# EasyEDA Pro project ProPrj_光耦隔离输入.epro

# Schematic Schematic1

## Sheets
1 光耦隔离输出: Board Name: Board1; Create Date: 2025-10-12; Page Name: 光耦隔离输出; Project Name: 光耦隔离输入; Schematic Name: Schematic1; Update Date: 2025-10-21; Company: achenjiayi; Drawed: achenjiayi; Page Size: A4; Reviewed: achenjiayi; Version: V1.0
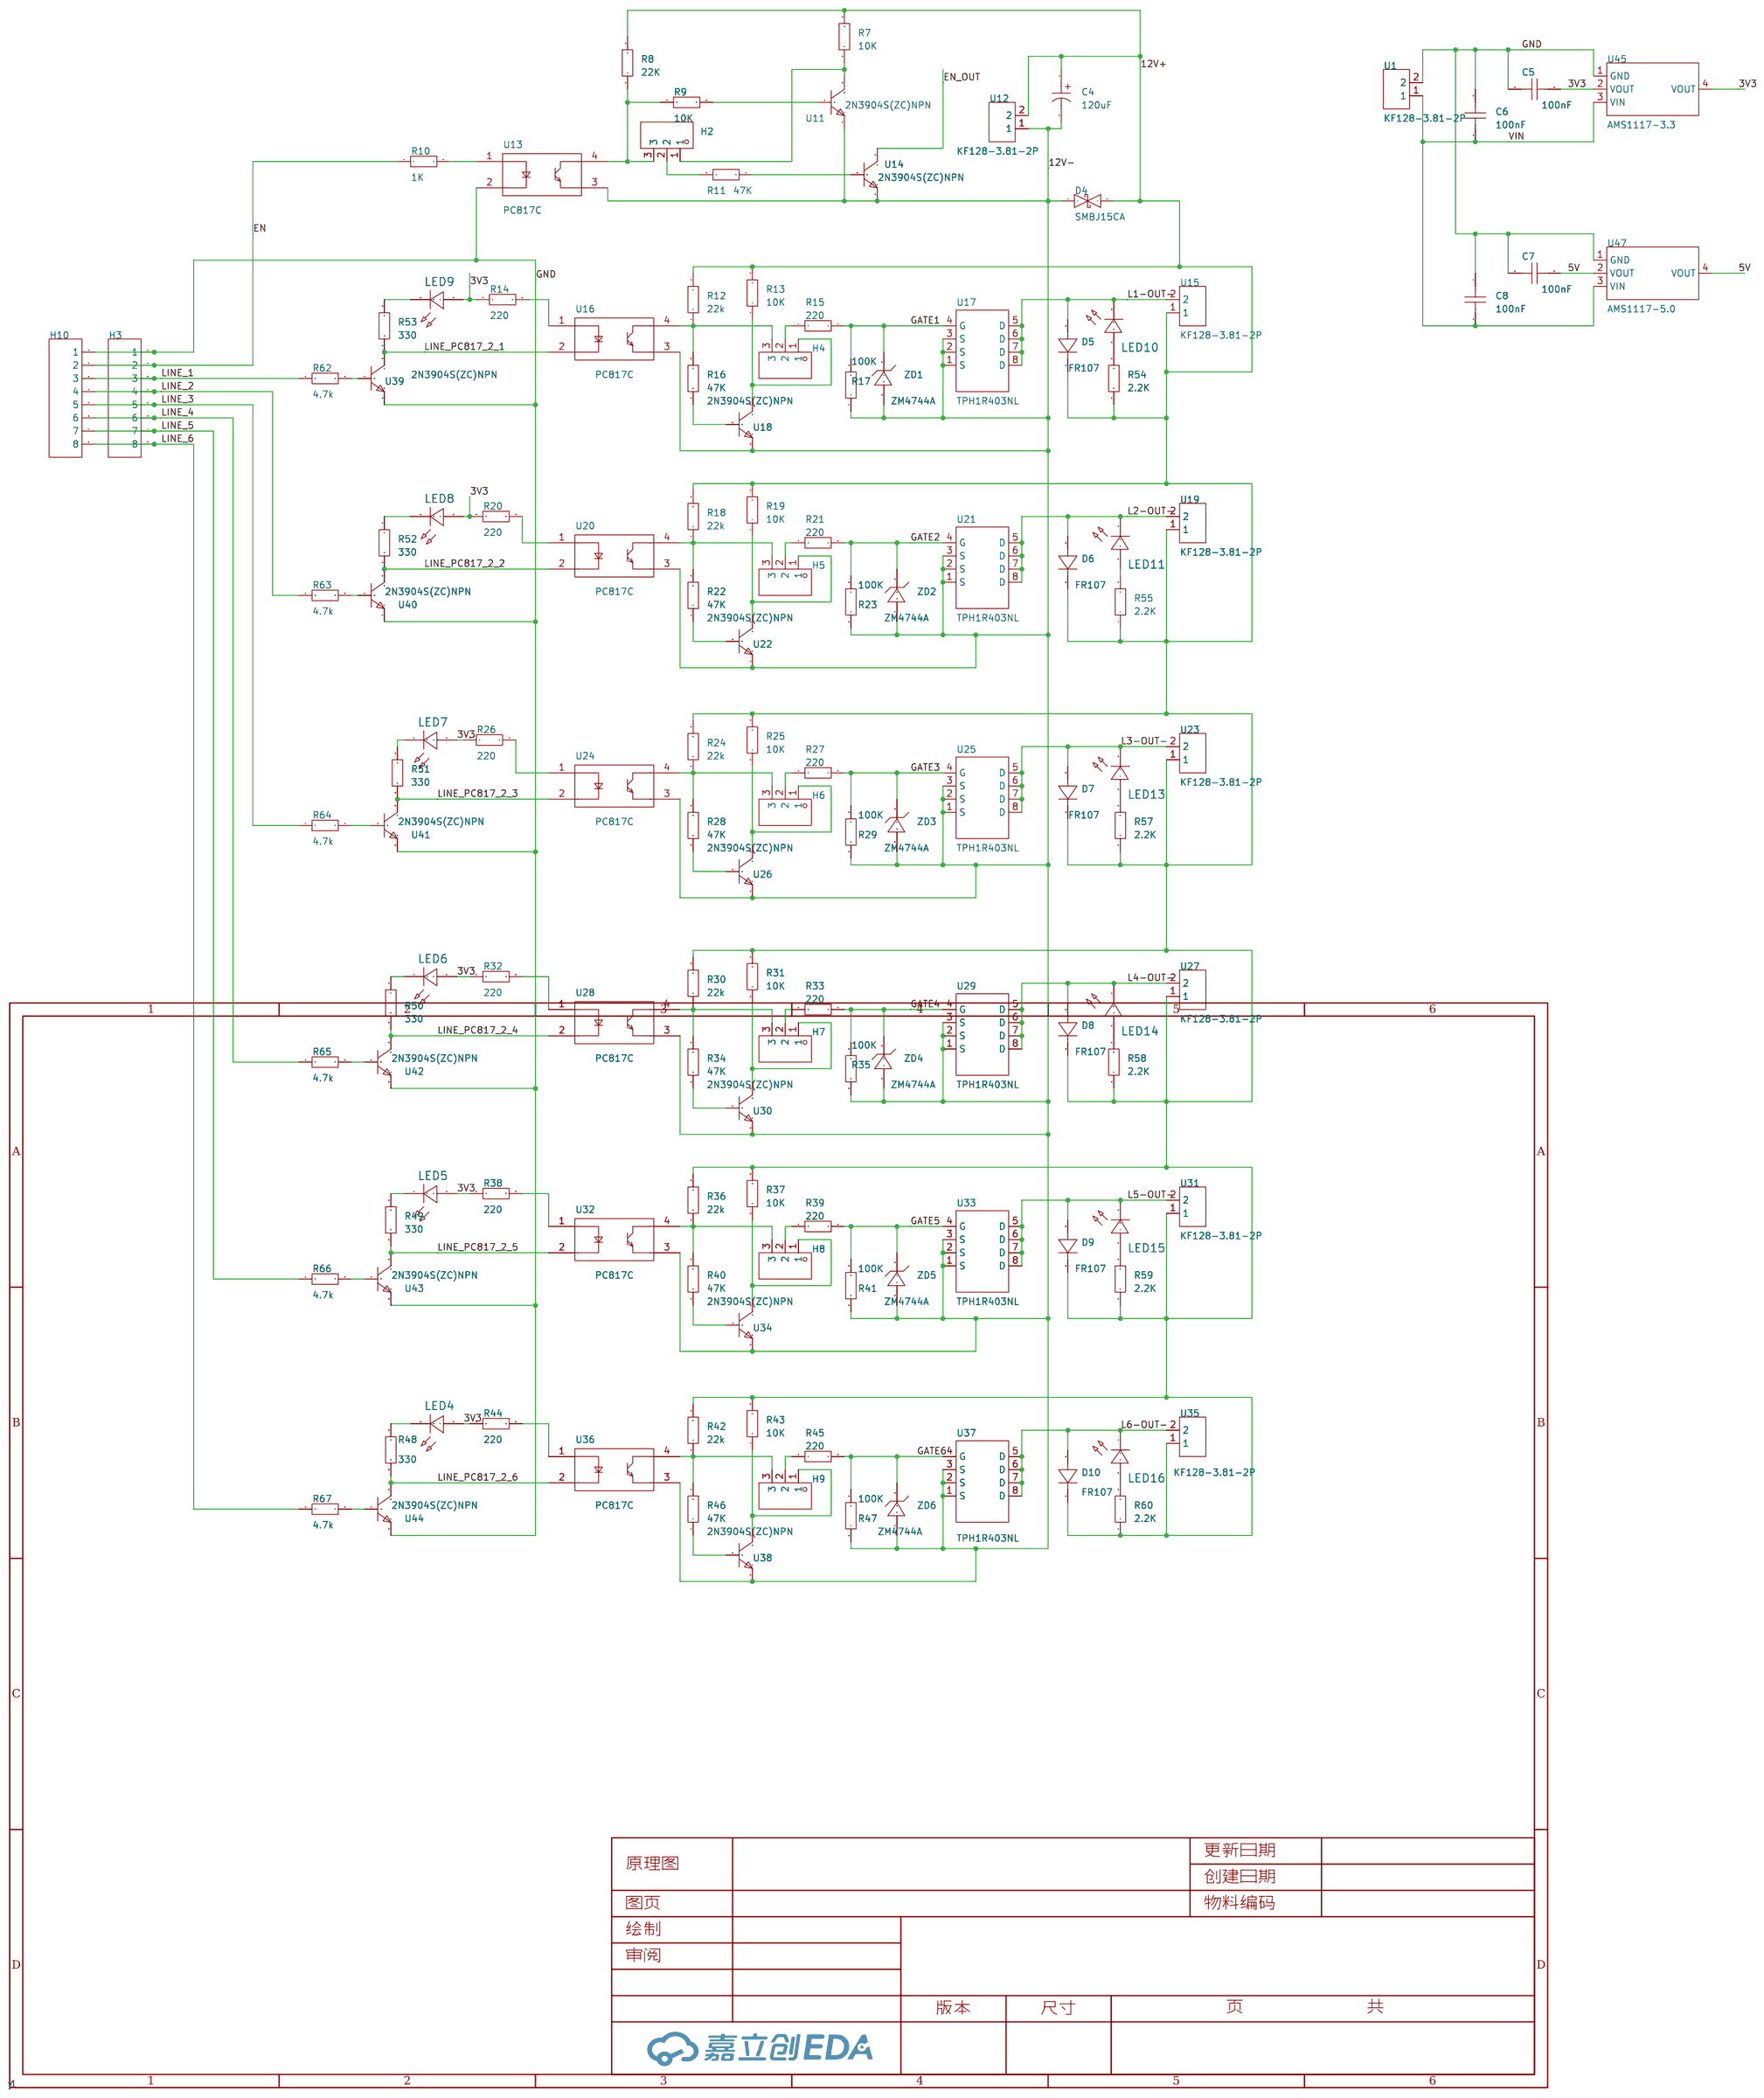
[diagram p0: 光耦隔离输出]
2 光耦隔离输入: Create Date: 2025-10-21; Page Name: 光耦隔离输入; Company: 嘉立创EDA
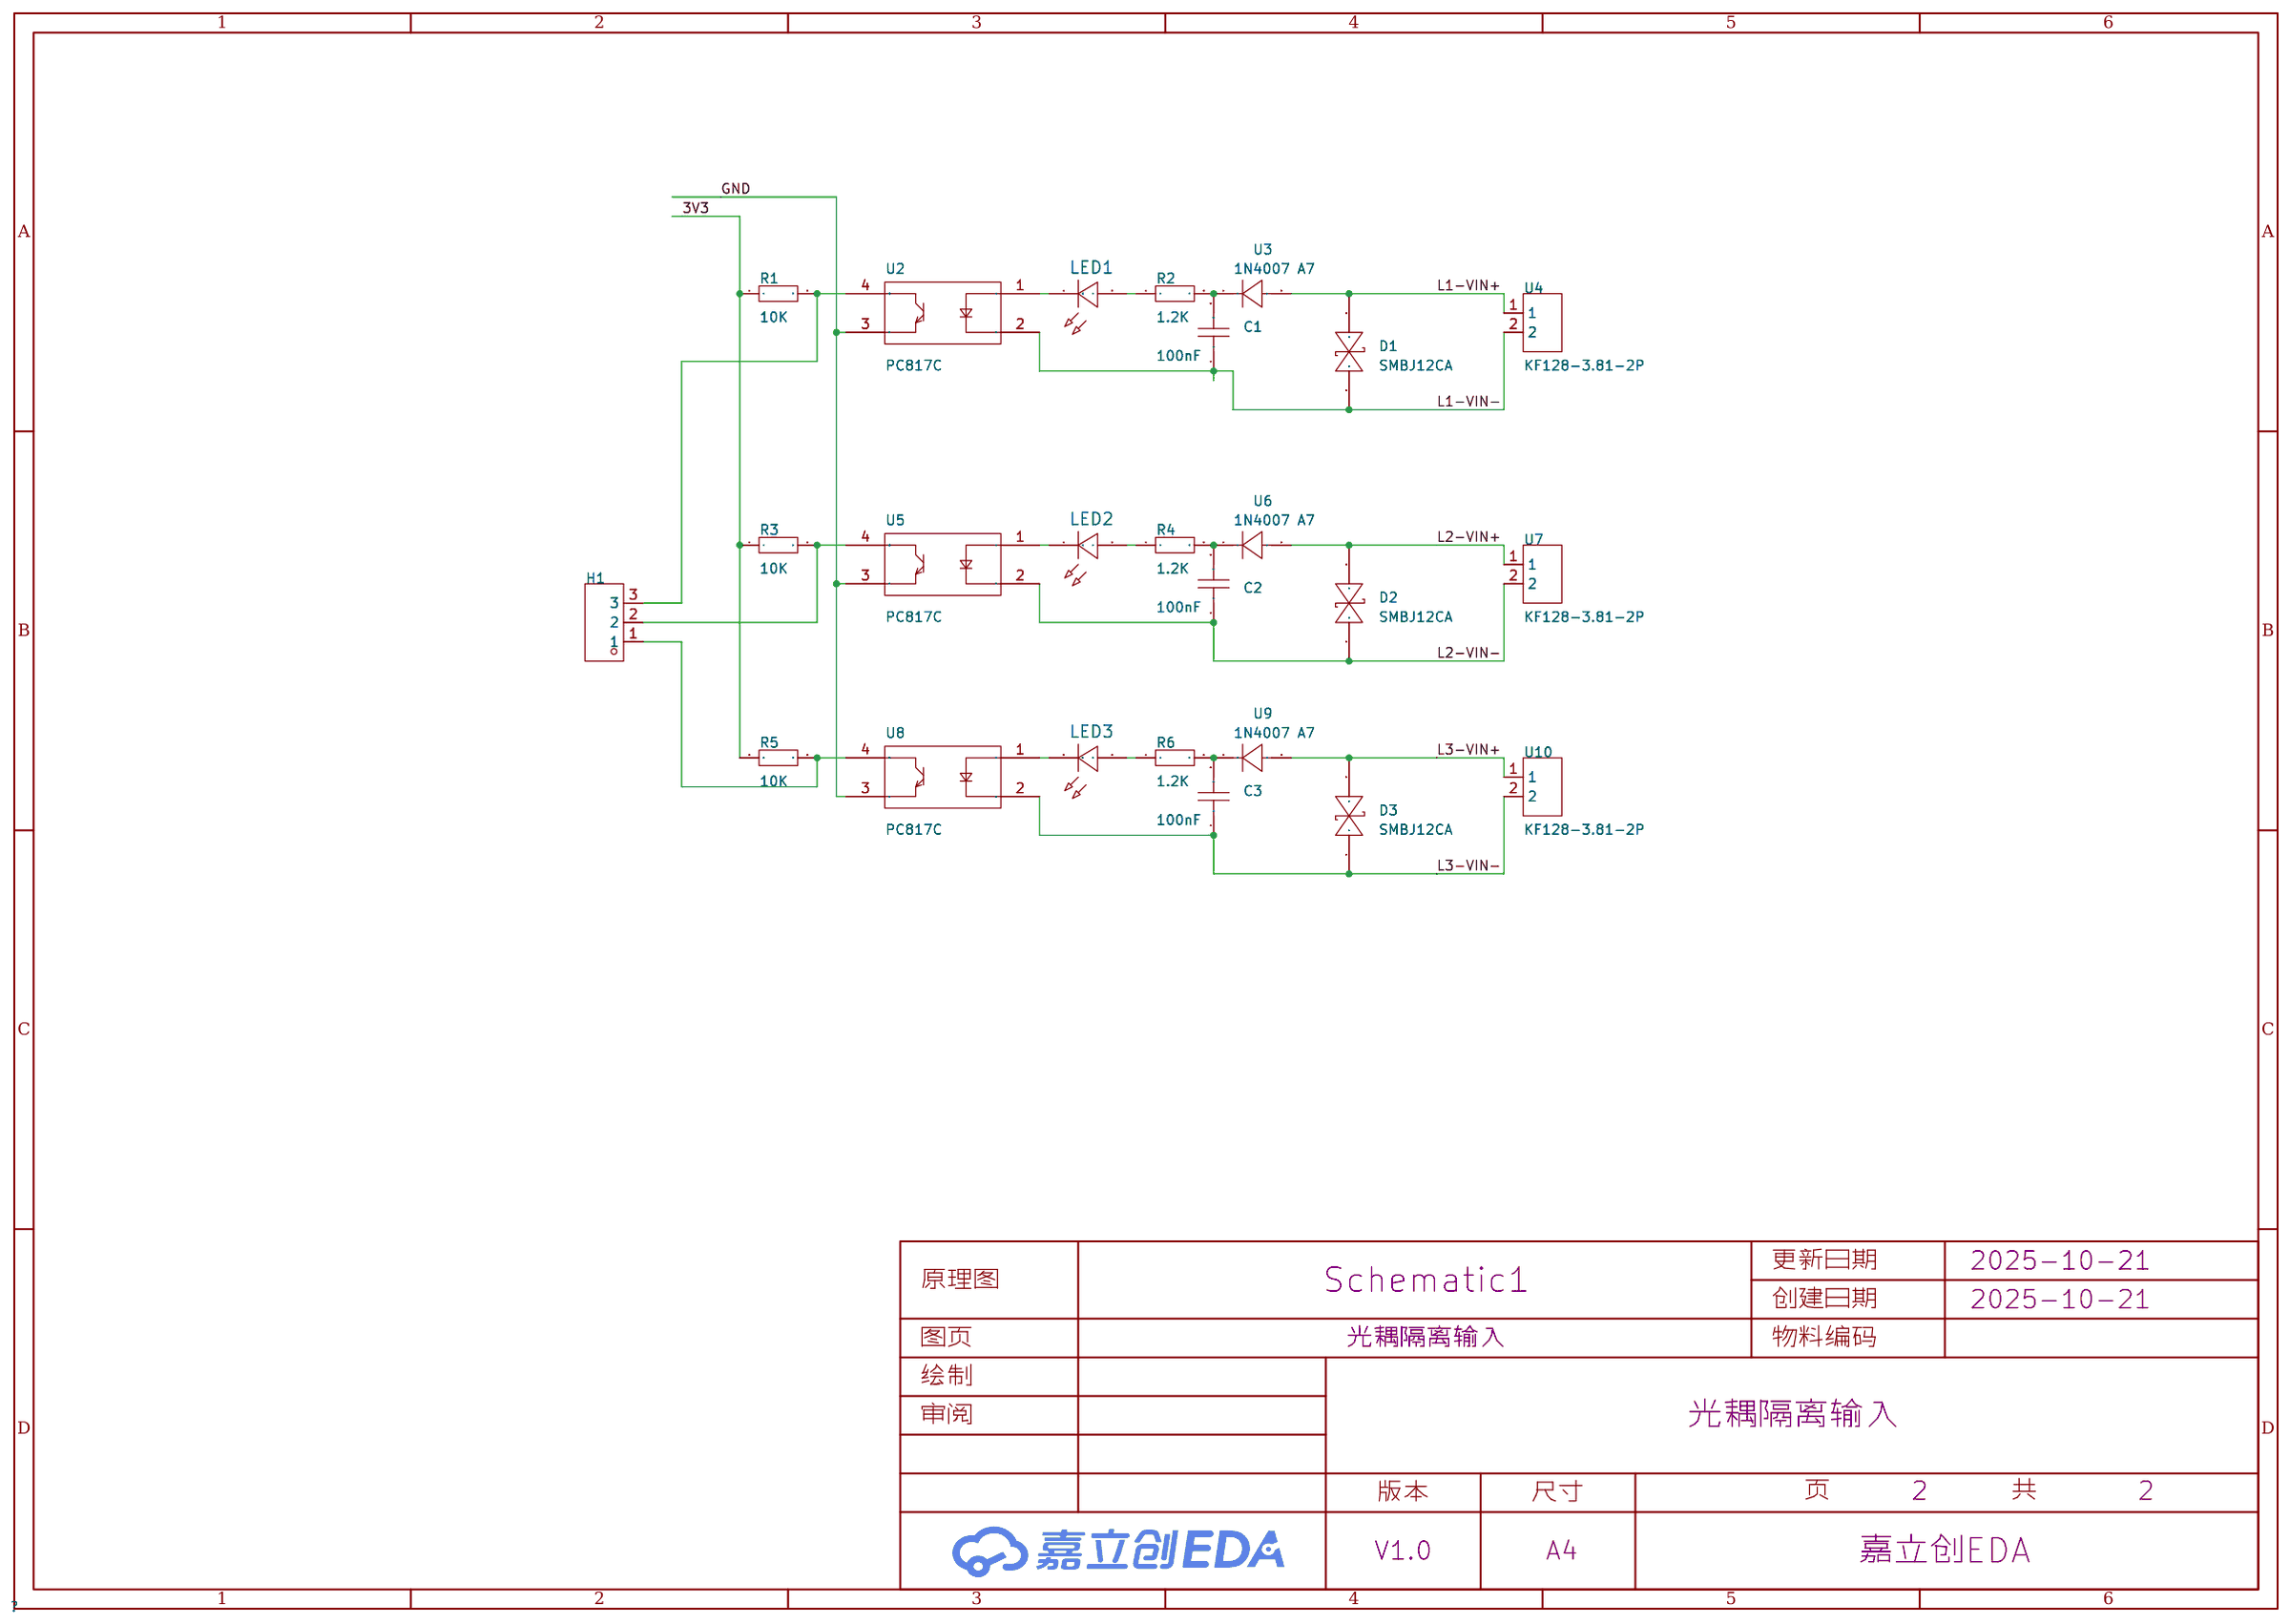
[diagram p1: 光耦隔离输入]

## Parts
sheet 光耦隔离输入
C1  100nF  [C0603]
C2  100nF  [C0603]
C3  100nF  [C0603]
D1  SMBJ12CA  [SMB_L4.6-W3.6-LS5.3-BI]
D2  SMBJ12CA  [SMB_L4.6-W3.6-LS5.3-BI]
D3  SMBJ12CA  [SMB_L4.6-W3.6-LS5.3-BI]
H1  -  [HDR-TH_3P-P2.54-V-M]
LED1  -  [LED_0603]
LED2  -  [LED_0603]
LED3  -  [LED_0603]
R1  10K  [R0603]
R2  1.2K  [R0603]
R3  10K  [R0603]
R4  1.2K  [R0603]
R5  10K  [R0603]
R6  1.2K  [R0603]
U2  PC817C  [OPTO-SMD-4_L4.6-W6.5-P2.54-LS10.3-TL]
U3  1N4007 A7  [SOD-123FL_L2.7-W1.8-LS3.8-RD]
U4  KF128-3.81-2P  [CONN-TH_2P-P3.81_KF128-3.81-2P]
U5  PC817C  [OPTO-SMD-4_L4.6-W6.5-P2.54-LS10.3-TL]
U6  1N4007 A7  [SOD-123FL_L2.7-W1.8-LS3.8-RD]
U7  KF128-3.81-2P  [CONN-TH_2P-P3.81_KF128-3.81-2P]
U8  PC817C  [OPTO-SMD-4_L4.6-W6.5-P2.54-LS10.3-TL]
U9  1N4007 A7  [SOD-123FL_L2.7-W1.8-LS3.8-RD]
U10  KF128-3.81-2P  [CONN-TH_2P-P3.81_KF128-3.81-2P]
sheet 光耦隔离输出
C4  120uF  [CAP-TH_BD6.3-P2.50-D0.5-FD]
C5  100nF  [C0603]
C6  100nF  [C0603]
C7  100nF  [C0603]
C8  100nF  [C0603]
D4  SMBJ15CA  [SMB_L4.6-W3.6-LS5.3-BI]
D5  FR107  [SOD-123_L2.8-W1.8-LS3.7-RD]
D6  FR107  [SOD-123_L2.8-W1.8-LS3.7-RD]
D7  FR107  [SOD-123_L2.8-W1.8-LS3.7-RD]
D8  FR107  [SOD-123_L2.8-W1.8-LS3.7-RD]
D9  FR107  [SOD-123_L2.8-W1.8-LS3.7-RD]
D10  FR107  [SOD-123_L2.8-W1.8-LS3.7-RD]
H2  -  [HDR-TH_3P-P2.54-V-M]
H3  -  [HDR-TH_8P-P2.54-V-M]
H4  -  [HDR-TH_3P-P2.54-V-M]
H5  -  [HDR-TH_3P-P2.54-V-M]
H6  -  [HDR-TH_3P-P2.54-V-M]
H7  -  [HDR-TH_3P-P2.54-V-M]
H8  -  [HDR-TH_3P-P2.54-V-M]
H9  -  [HDR-TH_3P-P2.54-V-M]
H10  -  [HDR-TH_8P-P2.54-V-M]
LED4  -  [LED_0603]
LED5  -  [LED_0603]
LED6  -  [LED_0603]
LED7  -  [LED_0603]
LED8  -  [LED_0603]
LED9  -  [LED_0603]
LED10  -  [LED_0603]
LED11  -  [LED_0603]
LED13  -  [LED_0603]
LED14  -  [LED_0603]
LED15  -  [LED_0603]
LED16  -  [LED_0603]
R7  10K  [R0603]
R8  22K  [R0603]
R9  10K  [R0603]
R10  1K  [R0603]
R11  47K  [R0603]
R12  22k  [R0603]
R13  10K  [R0603]
R14  220  [R0603]
R15  220  [R0603]
R16  47K  [R0603]
R17  100K  [R0603]
R18  22k  [R0603]
R19  10K  [R0603]
R20  220  [R0603]
R21  220  [R0603]
R22  47K  [R0603]
R23  100K  [R0603]
R24  22k  [R0603]
R25  10K  [R0603]
R26  220  [R0603]
R27  220  [R0603]
R28  47K  [R0603]
R29  100K  [R0603]
R30  22k  [R0603]
R31  10K  [R0603]
R32  220  [R0603]
R33  220  [R0603]
R34  47K  [R0603]
R35  100K  [R0603]
R36  22k  [R0603]
R37  10K  [R0603]
R38  220  [R0603]
R39  220  [R0603]
R40  47K  [R0603]
R41  100K  [R0603]
R42  22k  [R0603]
R43  10K  [R0603]
R44  220  [R0603]
R45  220  [R0603]
R46  47K  [R0603]
R47  100K  [R0603]
R48  330  [R0603]
R49  330  [R0603]
R50  330  [R0603]
R51  330  [R0603]
R52  330  [R0603]
R53  330  [R0603]
R54  2.2K  [R0603]
R55  2.2K  [R0603]
R57  2.2K  [R0603]
R58  2.2K  [R0603]
R59  2.2K  [R0603]
R60  2.2K  [R0603]
R62  4.7k  [R0603]
R63  4.7k  [R0603]
R64  4.7k  [R0603]
R65  4.7k  [R0603]
R66  4.7k  [R0603]
R67  4.7k  [R0603]
U1  KF128-3.81-2P  [CONN-TH_2P-P3.81_KF128-3.81-2P]
U11  2N3904S(ZC)NPN  [SOT-23-3_L2.9-W1.3-P0.95-LS2.4-BR]
U12  KF128-3.81-2P  [CONN-TH_2P-P3.81_KF128-3.81-2P]
U13  PC817C  [OPTO-SMD-4_L4.6-W6.5-P2.54-LS10.3-TL]
U14  2N3904S(ZC)NPN  [SOT-23-3_L2.9-W1.3-P0.95-LS2.4-BR]
U15  KF128-3.81-2P  [CONN-TH_2P-P3.81_KF128-3.81-2P]
U16  PC817C  [OPTO-SMD-4_L4.6-W6.5-P2.54-LS10.3-TL]
U17  TPH1R403NL  [DFN-8_L5.0-W5.0-P1.27-LS6.0-EP]
U18  2N3904S(ZC)NPN  [SOT-23-3_L2.9-W1.3-P0.95-LS2.4-BR]
U19  KF128-3.81-2P  [CONN-TH_2P-P3.81_KF128-3.81-2P]
U20  PC817C  [OPTO-SMD-4_L4.6-W6.5-P2.54-LS10.3-TL]
U21  TPH1R403NL  [DFN-8_L5.0-W5.0-P1.27-LS6.0-EP]
U22  2N3904S(ZC)NPN  [SOT-23-3_L2.9-W1.3-P0.95-LS2.4-BR]
U23  KF128-3.81-2P  [CONN-TH_2P-P3.81_KF128-3.81-2P]
U24  PC817C  [OPTO-SMD-4_L4.6-W6.5-P2.54-LS10.3-TL]
U25  TPH1R403NL  [DFN-8_L5.0-W5.0-P1.27-LS6.0-EP]
U26  2N3904S(ZC)NPN  [SOT-23-3_L2.9-W1.3-P0.95-LS2.4-BR]
U27  KF128-3.81-2P  [CONN-TH_2P-P3.81_KF128-3.81-2P]
U28  PC817C  [OPTO-SMD-4_L4.6-W6.5-P2.54-LS10.3-TL]
U29  TPH1R403NL  [DFN-8_L5.0-W5.0-P1.27-LS6.0-EP]
U30  2N3904S(ZC)NPN  [SOT-23-3_L2.9-W1.3-P0.95-LS2.4-BR]
U31  KF128-3.81-2P  [CONN-TH_2P-P3.81_KF128-3.81-2P]
U32  PC817C  [OPTO-SMD-4_L4.6-W6.5-P2.54-LS10.3-TL]
U33  TPH1R403NL  [DFN-8_L5.0-W5.0-P1.27-LS6.0-EP]
U34  2N3904S(ZC)NPN  [SOT-23-3_L2.9-W1.3-P0.95-LS2.4-BR]
U35  KF128-3.81-2P  [CONN-TH_2P-P3.81_KF128-3.81-2P]
U36  PC817C  [OPTO-SMD-4_L4.6-W6.5-P2.54-LS10.3-TL]
U37  TPH1R403NL  [DFN-8_L5.0-W5.0-P1.27-LS6.0-EP]
U38  2N3904S(ZC)NPN  [SOT-23-3_L2.9-W1.3-P0.95-LS2.4-BR]
U39  2N3904S(ZC)NPN  [SOT-23-3_L2.9-W1.3-P0.95-LS2.4-BR]
U40  2N3904S(ZC)NPN  [SOT-23-3_L2.9-W1.3-P0.95-LS2.4-BR]
U41  2N3904S(ZC)NPN  [SOT-23-3_L2.9-W1.3-P0.95-LS2.4-BR]
U42  2N3904S(ZC)NPN  [SOT-23-3_L2.9-W1.3-P0.95-LS2.4-BR]
U43  2N3904S(ZC)NPN  [SOT-23-3_L2.9-W1.3-P0.95-LS2.4-BR]
U44  2N3904S(ZC)NPN  [SOT-23-3_L2.9-W1.3-P0.95-LS2.4-BR]
U45  AMS1117-3.3  [SOT-223-3_L6.5-W3.4-P2.30-LS7.0-BR]
U47  AMS1117-5.0  [SOT-223_L6.5-W3.5-P2.30-LS7.0-BR]
ZD1  ZM4744A  [LL-41_L5.0-W2.5-LS5.0-RD]
ZD2  ZM4744A  [LL-41_L5.0-W2.5-LS5.0-RD]
ZD3  ZM4744A  [LL-41_L5.0-W2.5-LS5.0-RD]
ZD4  ZM4744A  [LL-41_L5.0-W2.5-LS5.0-RD]
ZD5  ZM4744A  [LL-41_L5.0-W2.5-LS5.0-RD]
ZD6  ZM4744A  [LL-41_L5.0-W2.5-LS5.0-RD]

## Library data of the parts
C1-C3 C5-C8 = CAP_0603: Supplier Footprint: 0603
D1-D3 = SMBJ12CA: 反向截止电压(Vrwm):12V;最大钳位电压:19.9V;峰值脉冲电流(Ipp):30.2A;击穿电压:13.3V;; Supplier Part: C143145; Manufacturer: FMS(美丽微); Supplier Footprint: SMB(DO-214AA); JLCPCB Part Class: 扩展库; Datasheet: https://atta.szlcsc.com/upload/public/pdf/source/20191125/C461412_D06D094152DCAA63D23E11D143615915.pdf; Supplier: LCSC; Reverse Stand-Off Voltage (Vrwm): 12V; Maximum Clamping Voltage: 19.9V; Peak Pulse Current (Ipp): 30.2A; Breakdown Voltage: 13.3V; Reverse Leakage Current (Ir): 5uA; Type: TVS
H1 H2 H4-H9 = HDR-M_2.54_1x3P: Supplier Part: C2937625; Supplier Footprint: 插件
LED1-LED11 LED13-LED16 = LED_0603-R: Supplier Footprint: 0603
R1-R55 R57-R60 R62-R67 = Res_0603: Supplier Footprint: 0603
U2 U5 U8 U13 U16 U20 U24 U28 U32 U36 = PC817C_C3025164: 输入类型:DC;正向压降(Vf):1.2V;输出电流:50mA;隔离电压(Vrms):5kV;直流反向耐压(Vr):6V;负载电压:35V;输出通道数:1;集射极饱和电压(VCE(sat)):100mV@1mA,20mA;; LCSC Part Name: C档 光电晶体管光电耦合器; Supplier Part: C3025164; Manufacturer: GOODWORK(固得沃克); Supplier Footprint: SMD-4P; JLCPCB Part Class: Extended Part; Datasheet: https://item.szlcsc.com/datasheet/PC817C/3553773.html; Supplier: LCSC; Input type: DC; Output Type: 光电三极管; Voltage - Forward(Vf): 1.2V; Output Current: 50mA; Isolation Voltage(Vrms): 5kV; Reverse Voltage: 6V; Load Voltage: 35V; Number of Outputs: 1; Vce Saturation(VCE(sat)): 100mV@1mA,20mA; Rise time: 6us@2mA,100Ω; Fall time: 5us; Operating Temperature: -55℃~+110℃; Current Transfer Ratio (CTR) Minimum: 200%; Current Transfer Ratio (CTR) Maximum/Saturation Value: 400%; Forward Current(If): 50mA
U3 U6 U9 = 1N4007 A7_C727082: 二极管配置:独立式;正向压降(Vf):1.1V@1A;直流反向耐压(Vr):1kV;整流电流:1A;; LCSC Part Name: 1N4007; Supplier Part: C727082; Manufacturer: TWGMC(台湾迪嘉); Supplier Footprint: SOD-123FL; JLCPCB Part Class: Extended Part; Datasheet: https://item.szlcsc.com/datasheet/1N4007%2520A7/774187.html; Supplier: LCSC; Diode Configuration: 独立式; Voltage - Forward(Vf@If): 1.1V@1A; Voltage - DC Reverse(Vr): 1kV; Current - Rectified: 1A; Reverse Leakage Current (Ir): 5uA; Non-Repetitive Peak Forward Surge Current: 25A; Operating Junction Temperature Range: -55℃~+125℃
U1 U4 U7 U10 U12 U15 U19 U23 U27 U31 U35 = KF128-3.81-2P_C9900030554: Supplier Part: C9900030554; Supplier Footprint: CONN-TH; JLCPCB Part Class: 扩展库; Supplier: LCSC
C4 = DHG035M127E090S1AA: 容值:120uF;精度:±20%;额定电压:35V;纹波电流:550mA@100kHz;等效串联电阻(ESR):150mΩ@100kHz;; LCSC Part Name: 120uF ±20% 35V; Supplier Part: C49309230; Manufacturer: KNSCHA(科尼盛); Supplier Footprint: 插件,D6.3xL9mm; JLCPCB Part Class: 扩展库; Datasheet: https://item.szlcsc.com/datasheet/DHG035M127E090S1AA/51779112.html; Supplier: LCSC; Tolerance: ±20%; Voltage Rating: 35V; Ripple Current: 550mA@100kHz; Equivalent Series Resistance(ESR): 150mΩ@100kHz; Pin Spacing: 2.5mm; Diameter: 6.3mm; Height - Seated (Max): 9mm; Lifetime: 2000hrs@105℃; Operating Temperature: -40℃~+105℃
D4 = SMBJ15CA: 反向截止电压(Vrwm):15V;钳位电压:24.4V;峰值脉冲电流(Ipp):24.6A;击穿电压:16.7V;; Supplier Part: C330064; Manufacturer: JJW(捷捷微); Supplier Footprint: SMB; Datasheet: https://atta.szlcsc.com/upload/public/pdf/source/20181224/C338783_C30EB8BBB8C528D881F4F6A96936F798.pdf; Supplier: LCSC; Reverse Stand-Off Voltage (Vrwm): 15V; Clamping Voltage: 24.4V; Peak Pulse Current (Ipp): 24.6A; Voltage - Breakdown: 16.7V; Type: TVS
D5-D10 = FR107_C963379: 二极管配置:-;正向压降(Vf):1.3V@1A;直流反向耐压(Vr):1kV;整流电流:1A;反向恢复时间(Trr):500ns;; Supplier Part: C963379; Manufacturer: JSMSEMI(杰盛微); Supplier Footprint: SOD-123; JLCPCB Part Class: 扩展库; Datasheet: https://item.szlcsc.com/datasheet/FR107/1047090.html; Supplier: LCSC; Voltage - Forward(Vf@If): 1.3V@1A; Voltage - DC Reverse(Vr): 1kV; Current - Rectified: 1A; Reverse Leakage Current (Ir): 5uA@1kV; Reverse Recovery Time (trr): 500ns; Operating Junction Temperature Range: -55℃~+150℃; Non-Repetitive Peak Forward Surge Current: 25A
H3 H10 = HDR-M_2.54_1x8P: Supplier Part: C124381; Supplier Footprint: 插件; JLCPCB Part Class: 扩展库
U11 U14 U18 U22 U26 U30 U34 U38-U44 = 2N3904S(ZC)NPN: Supplier Part: C9900013034; Supplier Footprint: SOT-23; JLCPCB Part Class: 扩展库; Supplier: LCSC
U17 U21 U25 U29 U33 U37 = TPH1R403NL: Supplier Part: C9900016373; Supplier Footprint: DFN-8-EP(5x5); JLCPCB Part Class: 扩展库; Supplier: LCSC
U45 = AMS1117-3.3_C6186: 输出类型:固定;工作电压:16V;输出电压:3.3V;输出电流:1A;电源纹波抑制比(PSRR):72dB@(120Hz);输出极性:正极;; LCSC Part Name: 输出3.3V 1A; Supplier Part: C6186; Manufacturer: AMS; Supplier Footprint: SOT-223; Datasheet: https://item.szlcsc.com/datasheet/AMS1117-3.3/6652.html; Supplier: LCSC; Output Type: 固定; Voltage - Supply: 16V; Output Voltage: 3.3V; Output Current: 1A; Power Supply Rejection Ratio (PSRR): 72dB@(120Hz); Voltage Dropout: 1.1V@(800mA); standby current: 5mA; Noise: 0.003%Vout; Features: 过流保护；过热保护; Operating Temperature: -40℃~+125℃; Output Configuration: 正极; Number of Outputs: 1
U47 = AMS1117-5.0_C6187: 输出类型:固定;工作电压:15V;输出电压:5V;输出电流:1A;电源纹波抑制比(PSRR):60dB;输出极性:正极;; LCSC Part Name: 输入15V 输出5V 1A; Supplier Part: C6187; Manufacturer: AMS; Supplier Footprint: SOT-223; JLCPCB Part Class: 基础库; Datasheet: https://item.szlcsc.com/datasheet/AMS1117-5.0/6653.html; Supplier: LCSC; Output Type: 固定; Voltage - Supply: 15V; Output Voltage: 5V; Output Current: 1A; Power Supply Rejection Ratio (PSRR): 60dB; Voltage Dropout: 1.3V; Operating Temperature: -40℃~+125℃; Output Configuration: 正极; Number of Outputs: 1
ZD1-ZD6 = ZM4744A: 二极管配置:独立式;稳压值(标称值):15V;耗散功率(Pd):1W;; Supplier Part: C41253; Manufacturer: ST(先科); Supplier Footprint: LL-41; Datasheet: https://item.szlcsc.com/datasheet/ZM4744A/42237.html; Supplier: LCSC; Diode Configuration: 独立式; Zener Voltage(Nom): 15V; Reverse Leakage Current (Ir): 5uA@12.4V; Pd - Power Dissipation: 1W; Impedance(Zzt): 14Ω; Impedance(Zzk): 700Ω

## Nets
3V3: C5.2 LED4.2(A) LED5.2(A) LED6.2(A) LED7.2(A) LED8.2(A) LED9.2(A) R1.1 R3.1 R5.1 R14.1 R20.1 R26.1 R32.1 R38.1 R44.1 U45.2(VOUT) U45.4(VOUT)
5V: C7.2 U47.2(VOUT) U47.4(VOUT)
12V+: C4.1 D4.2(A) D5.1(C) D6.1(C) D7.1(C) D8.1(C) D9.1(C) D10.1(C) R7.2 R8.2 R12.2 R13.2 R18.2 R19.2 R24.2 R25.2 R30.2 R31.2 R36.2 R37.2 R42.2 R43.2 R54.1 R55.1 R57.1 R58.1 R59.1 R60.1 U12.2 U15.1 U19.1 U23.1 U27.1 U31.1 U35.1
12V-: C4.2 D4.1(K) R17.1 R23.1 R29.1 R35.1 R41.1 R47.1 U11.2(E) U12.1 U13.3(EM) U14.2(E) U16.3(EM) U17.1(S) U17.2(S) U17.3(S) U18.2(E) U20.3(EM) U21.1(S) U21.2(S) U21.3(S) U22.2(E) U24.3(EM) U25.1(S) U25.2(S) U25.3(S) U26.2(E) U28.3(EM) U29.1(S) U29.2(S) U29.3(S) U30.2(E) U32.3(EM) U33.1(S) U33.2(S) U33.3(S) U34.2(E) U36.3(EM) U37.1(S) U37.2(S) U37.3(S) U38.2(E) ZD1.1(A) ZD2.1(A) ZD3.1(A) ZD4.1(A) ZD5.1(A) ZD6.1(A)
GND: C5.1 C6.1 C7.1 C8.1 H3.1 H10.1 U1.2 U2.3(EM) U5.3(EM) U8.3(EM) U13.2(C) U39.2(E) U40.2(E) U41.2(E) U42.2(E) U43.2(E) U44.2(E) U45.1(GND) U47.1(GND)
VIN: C6.2 C8.2 U1.1 U45.3(VIN) U47.3(VIN)
EN: H3.2 H10.2 R10.1
EN_OUT: U14.3(C)
GATE1: R15.2 R17.2 U17.4(G) ZD1.2(K)
GATE2: R21.2 R23.2 U21.4(G) ZD2.2(K)
GATE3: R27.2 R29.2 U25.4(G) ZD3.2(K)
GATE4: R33.2 R35.2 U29.4(G) ZD4.2(K)
GATE5: R39.2 R41.2 U33.4(G) ZD5.2(K)
GATE6: R45.2 R47.2 U37.4(G) ZD6.2(K)
L1-OUT-: D5.2(A) LED10.1(C) U15.2 U17.5(D) U17.6(D) U17.7(D) U17.8(D)
L1-VIN+: D1.2 U3.2(A) U4.1
L1-VIN-: C1.1 D1.1 U2.2(C) U4.2
L2-OUT-: D6.2(A) LED11.1(C) U19.2 U21.5(D) U21.6(D) U21.7(D) U21.8(D)
L2-VIN+: D2.2 U6.2(A) U7.1
L2-VIN-: C2.1 D2.1 U5.2(C) U7.2
L3-OUT-: D7.2(A) LED13.1(C) U23.2 U25.5(D) U25.6(D) U25.7(D) U25.8(D)
L3-VIN+: D3.2 U9.2(A) U10.1
L3-VIN-: C3.1 D3.1 U8.2(C) U10.2
L4-OUT-: D8.2(A) LED14.1(C) U27.2 U29.5(D) U29.6(D) U29.7(D) U29.8(D)
L5-OUT-: D9.2(A) LED15.1(C) U31.2 U33.5(D) U33.6(D) U33.7(D) U33.8(D)
L6-OUT-: D10.2(A) LED16.1(C) U35.2 U37.5(D) U37.6(D) U37.7(D) U37.8(D)
LINE_1: H3.3 H10.3 R62.1
LINE_2: H3.4 H10.4 R63.1
LINE_3: H3.5 H10.5 R64.1
LINE_4: H3.6 H10.6 R65.1
LINE_5: H3.7 H10.7 R66.1
LINE_6: H3.8 H10.8 R67.1
LINE_PC817_2_1: R53.2 U16.2(C) U39.3(C)
LINE_PC817_2_2: R52.2 U20.2(C) U40.3(C)
LINE_PC817_2_3: R51.2 U24.2(C) U41.3(C)
LINE_PC817_2_4: R50.2 U28.2(C) U42.3(C)
LINE_PC817_2_5: R49.2 U32.2(C) U43.3(C)
LINE_PC817_2_6: R48.2 U36.2(C) U44.3(C)
$1N3555: H4.1 R13.1 U18.3(C)
$1N3692: R16.1 U18.1(B)
$1N3696: H4.3 R12.1 R16.2 U16.4(COL)
$1N3855: H4.2 R15.1
$1N6078: H2.3 R8.1 R9.1 U13.4(COL)
$1N6285: R9.2 U11.1(B)
$1N6498: H2.1 R7.1 U11.3(C)
$1N7595: R22.1 U22.1(B)
$1N7596: H5.1 R19.1 U22.3(C)
$1N7601: H5.3 R18.1 R22.2 U20.4(COL)
$1N7602: H5.2 R21.1
$1N7603: R20.2 U20.1(A)
$1N10434: H6.3 R24.1 R28.2 U24.4(COL)
$1N10443: H6.1 R25.1 U26.3(C)
$1N10444: H6.2 R27.1
$1N10445: R28.1 U26.1(B)
$1N10701: H2.2 R11.2
$1N10706: R11.1 U14.1(B)
$1N10712: R10.2 U13.1(A)
$1N13584: H8.1 R37.1 U34.3(C)
$1N13585: H8.3 R36.1 R40.2 U32.4(COL)
$1N13586: H8.2 R39.1
$1N13593: R46.1 U38.1(B)
$1N13594: H9.3 R42.1 R46.2 U36.4(COL)
$1N13599: H9.1 R43.1 U38.3(C)
$1N13600: H9.2 R45.1
$1N13602: R40.1 U34.1(B)
$1N13606: H7.1 R31.1 U30.3(C)
$1N13609: H7.3 R30.1 R34.2 U28.4(COL)
$1N13610: R34.1 U30.1(B)
$1N13611: H7.2 R33.1
$1N16915: LED9.1(C) R53.1
$1N19054: LED10.2(A) R54.2
$1N19258: LED11.2(A) R55.2
$1N19424: LED13.2(A) R57.2
$1N19558: LED14.2(A) R58.2
$1N19703: LED15.2(A) R59.2
$1N19842: LED16.2(A) R60.2
$1N28737: R62.2 U39.1(B)
$1N28922: R14.2 U16.1(A)
$1N28949: LED8.1(C) R52.1
$1N29020: R63.2 U40.1(B)
$1N29206: R26.2 U24.1(A)
$1N29280: LED7.1(C) R51.1
$1N29286: R64.2 U41.1(B)
$1N29399: R65.2 U42.1(B)
$1N29408: LED6.1(C) R50.1
$1N29418: R32.2 U28.1(A)
$1N29537: R38.2 U32.1(A)
$1N29548: LED5.1(C) R49.1
$1N29553: R66.2 U43.1(B)
$1N29675: R67.2 U44.1(B)
$1N29685: LED4.1(C) R48.1
$1N29695: R44.2 U36.1(A)
$2N821: C1.2 R2.2 U3.1(K)
$2N826: H1.3 R1.2 U2.4(COL)
$2N829: LED1.1(C) U2.1(A)
$2N830: LED1.2(A) R2.1
$2N833: C2.2 R4.2 U6.1(K)
$2N834: H1.2 R3.2 U5.4(COL)
$2N837: LED2.1(C) U5.1(A)
$2N838: LED2.2(A) R4.1
$2N841: C3.2 R6.2 U9.1(K)
$2N842: H1.1 R5.2 U8.4(COL)
$2N845: LED3.1(C) U8.1(A)
$2N846: LED3.2(A) R6.1

# Board PCB1
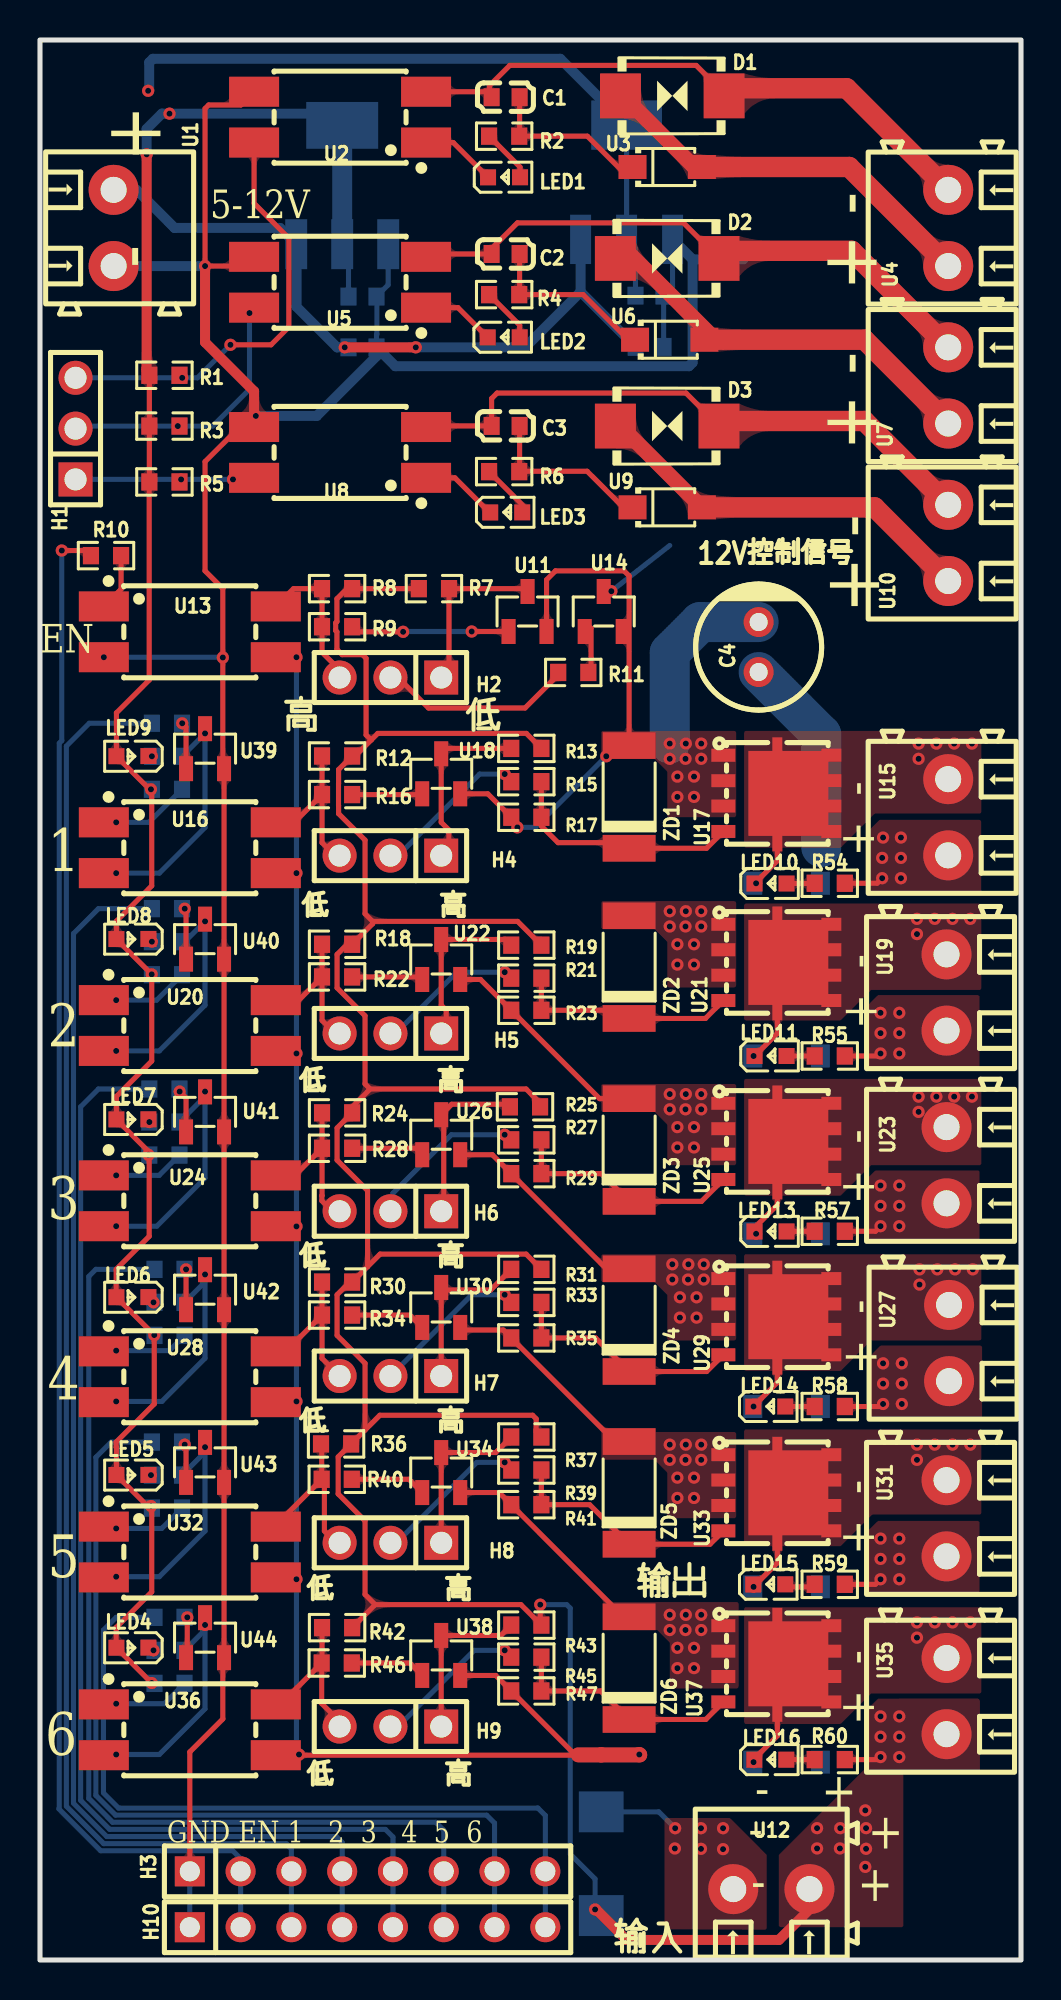
[diagram p2: board, top side]
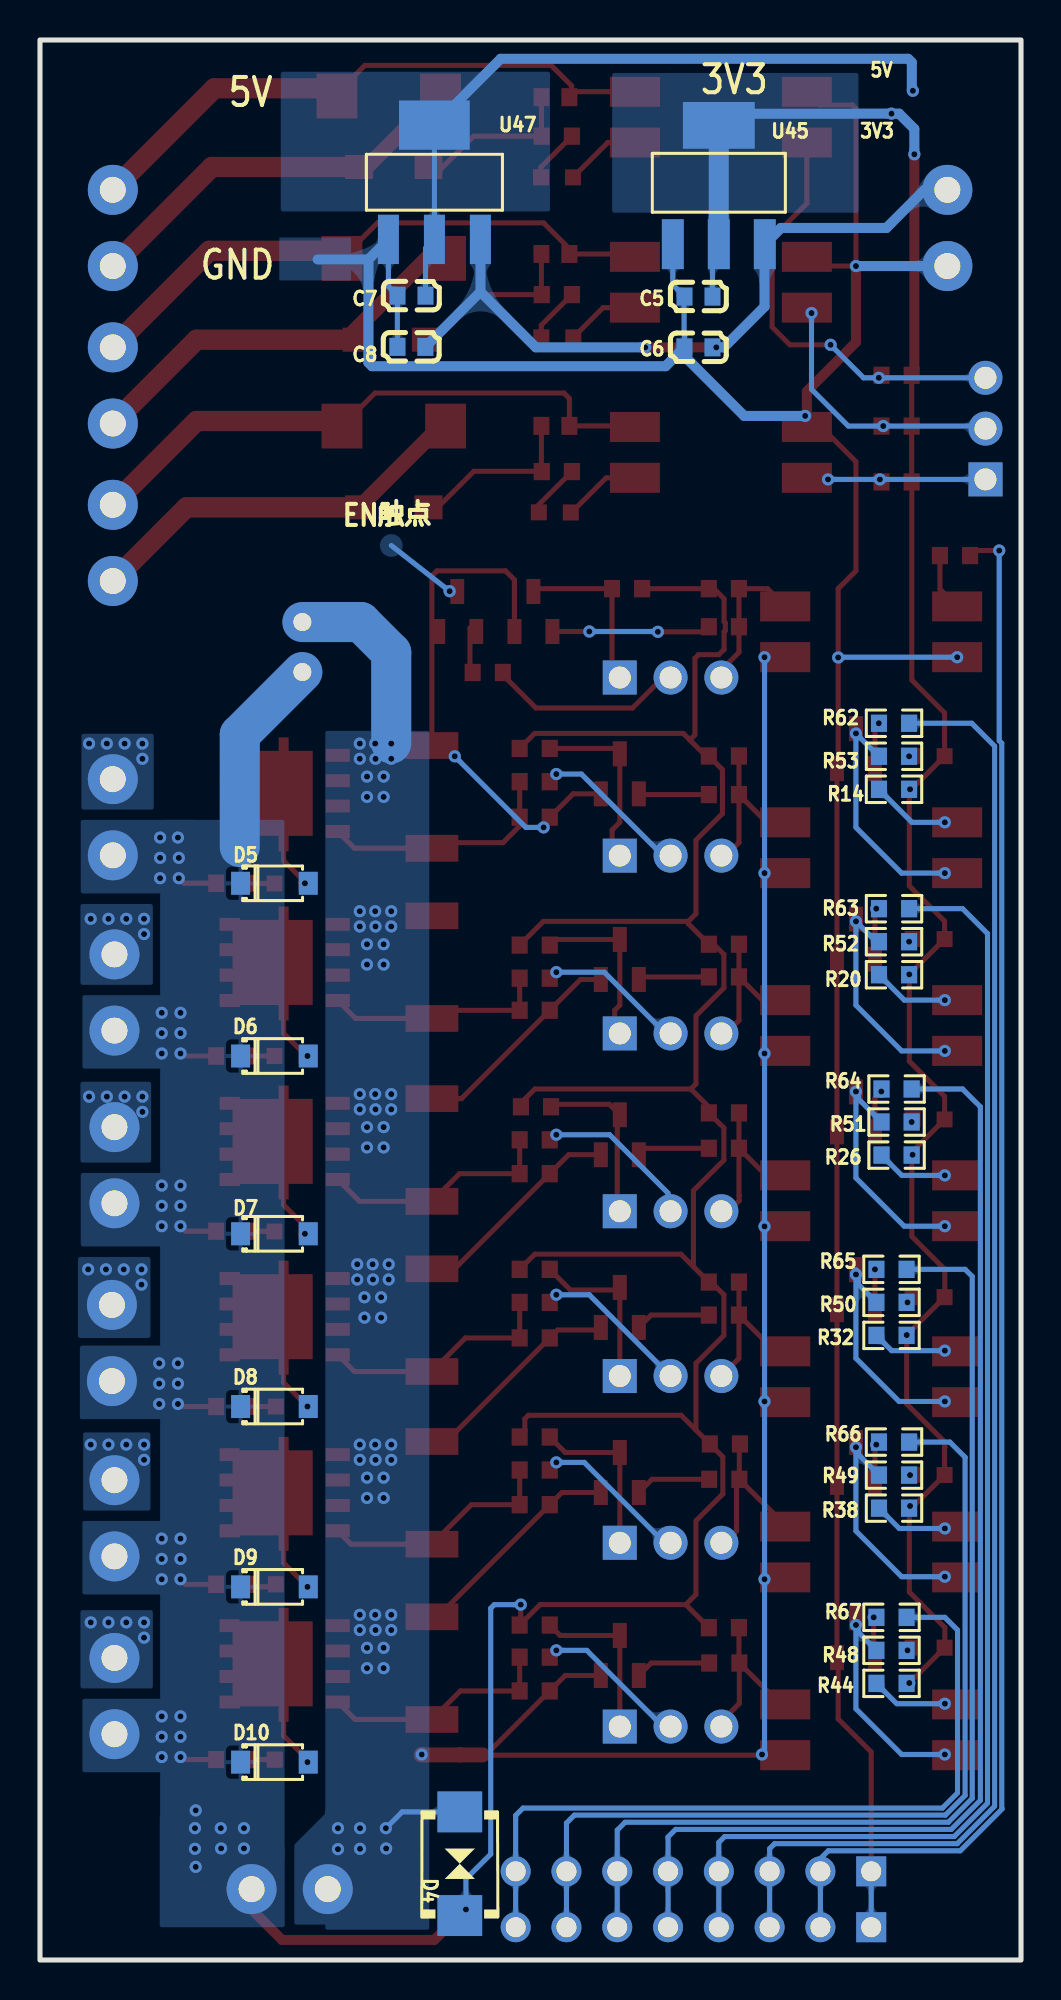
[diagram p3: board, bottom side, seen from below]

Outline 49.06 x 96 mm; copper layers: Top Layer, Bottom Layer. Coordinates in mm from the lower left corner of the outline.
Outline path: rectangle 0,96 49.06,0
Stack: Top Layer 0.035mm / Dielectric1 1.51mm FR4 er 4.5 / Bottom Layer 0.035mm

## Design rules (mm)
template: 自定义配置
spacing copperThickness1oz (default): track to track 0.102, other pairs 0.152 to 0.3
spacing copperThickness2oz: track to track 0.203, other pairs 0.152 to 0.3
track width copperThickness1oz (default): min 0.127, default 0.254, max 2.54
track width copperThickness2oz: min 0.203, default 0.254, max 2.54
differential pair differentialPair (default): width min 0.127, default 0.254, max 2.54; gap min 0.152, default 0.152
via viaSize (default): diameter min 0.5, default 0.61, max 10; hole min 0.3, default 0.305, max 6.3
net 3V3 uses 大功率copperRegion1
net 12V- uses 大功率copperRegion1
net L1-OUT- uses 大功率copperRegion1
net L2-OUT- uses 大功率copperRegion1
net L3-OUT- uses 大功率copperRegion1
net L4-OUT- uses 大功率copperRegion1
net L5-OUT- uses 大功率copperRegion1
net L6-OUT- uses 大功率copperRegion1
net 5V uses 大功率copperRegion1

## Placement (name value [footprint] x y rotation side)
C1  100nF  [C0603]  23.29 93.14 0 top
C2  100nF  [C0603]  23.29 85.3 0 top
C3  100nF  [C0603]  23.29 76.7 0 top
C4  120uF  [CAP-TH_BD6.3-P2.50-D0.5-FD]  35.94 65.65 90 top
C5  100nF  [C0603]  16.13 83.17 180 bottom
C6  100nF  [C0603]  16.13 80.63 180 bottom
C7  100nF  [C0603]  30.48 83.22 180 bottom
C8  100nF  [C0603]  30.49 80.66 180 bottom
D1  SMBJ12CA  [SMB_L4.6-W3.6-LS5.3-BI]  31.62 93.21 180 top
D2  SMBJ12CA  [SMB_L4.6-W3.6-LS5.3-BI]  31.37 85.08 180 top
D3  SMBJ12CA  [SMB_L4.6-W3.6-LS5.3-BI]  31.37 76.7 180 top
D4  SMBJ15CA  [SMB_L4.6-W3.6-LS5.3-BI]  28.07 4.81 270 bottom
D5  FR107  [SOD-123_L2.8-W1.8-LS3.7-RD]  37.34 53.84 180 bottom
D6  FR107  [SOD-123_L2.8-W1.8-LS3.7-RD]  37.34 45.2 180 bottom
D7  FR107  [SOD-123_L2.8-W1.8-LS3.7-RD]  37.34 36.31 180 bottom
D8  FR107  [SOD-123_L2.8-W1.8-LS3.7-RD]  37.34 27.67 180 bottom
D9  FR107  [SOD-123_L2.8-W1.8-LS3.7-RD]  37.34 18.66 180 bottom
D10  FR107  [SOD-123_L2.8-W1.8-LS3.7-RD]  37.34 9.89 180 bottom
H1  -  [HDR-TH_3P-P2.54-V-M]  1.78 76.57 90 top
H2  -  [HDR-TH_3P-P2.54-V-M]  17.53 64.12 180 top
H3  -  [HDR-TH_8P-P2.54-V-M]  16.38 4.43 0 top
H4  -  [HDR-TH_3P-P2.54-V-M]  17.53 55.22 180 top
H5  -  [HDR-TH_3P-P2.54-V-M]  17.53 46.33 180 top
H6  -  [HDR-TH_3P-P2.54-V-M]  17.53 37.44 180 top
H7  -  [HDR-TH_3P-P2.54-V-M]  17.53 29.2 180 top
H8  -  [HDR-TH_3P-P2.54-V-M]  17.53 20.86 180 top
H9  -  [HDR-TH_3P-P2.54-V-M]  17.53 11.67 180 top
H10  -  [HDR-TH_8P-P2.54-V-M]  16.38 1.64 0 top
LED1  -  [LED_0603]  23.26 89.14 0 top
LED2  -  [LED_0603]  23.24 81.14 0 top
LED3  -  [LED_0603]  23.37 72.39 0 top
LED4  -  [LED_0603]  4.57 15.61 180 top
LED5  -  [LED_0603]  4.57 24.24 180 top
LED6  -  [LED_0603]  4.57 33.13 180 top
LED7  -  [LED_0603]  4.57 42.02 180 top
LED8  -  [LED_0603]  4.57 51.04 180 top
LED9  -  [LED_0603]  4.57 60.19 180 top
LED10  -  [LED_0603]  36.59 53.83 0 top
LED11  -  [LED_0603]  36.59 45.2 0 top
LED13  -  [LED_0603]  36.59 36.43 0 top
LED14  -  [LED_0603]  36.52 27.68 0 top
LED15  -  [LED_0603]  36.52 18.79 0 top
LED16  -  [LED_0603]  36.58 10.02 0 top
R1  10K  [R0603]  6.22 79.24 0 top
R2  1.2K  [R0603]  23.22 91.19 0 top
R3  10K  [R0603]  6.22 76.7 0 top
R4  1.2K  [R0603]  23.22 83.27 0 top
R5  10K  [R0603]  6.22 73.9 0 top
R6  1.2K  [R0603]  23.22 74.42 0 top
R7  10K  [R0603]  19.7 68.57 180 top
R8  22K  [R0603]  14.86 68.57 0 top
R9  10K  [R0603]  14.86 66.66 0 top
R10  1K  [R0603]  3.3 70.22 0 top
R11  47K  [R0603]  26.67 64.38 180 top
R12  22k  [R0603]  14.86 60.2 0 top
R13  10K  [R0603]  24.32 60.58 0 top
R14  220  [R0603]  6.35 58.53 0 bottom
R15  220  [R0603]  24.32 58.92 0 top
R16  47K  [R0603]  14.86 58.27 180 top
R17  100K  [R0603]  24.32 57.14 0 top
R18  22k  [R0603]  14.86 50.79 0 top
R19  10K  [R0603]  24.32 50.74 0 top
R20  220  [R0603]  6.35 49.26 0 bottom
R21  220  [R0603]  24.32 49.09 0 top
R22  47K  [R0603]  14.86 49.15 180 top
R23  100K  [R0603]  24.32 47.49 0 top
R24  22k  [R0603]  14.86 42.36 0 top
R25  10K  [R0603]  24.26 42.66 0 top
R26  220  [R0603]  6.22 40.25 0 bottom
R27  220  [R0603]  24.32 41.01 0 top
R28  47K  [R0603]  14.86 40.59 180 top
R29  100K  [R0603]  24.32 39.32 0 top
R30  22k  [R0603]  14.86 33.9 0 top
R31  10K  [R0603]  24.32 34.53 0 top
R32  220  [R0603]  6.48 31.23 0 bottom
R33  220  [R0603]  24.32 32.88 0 top
R34  47K  [R0603]  14.86 32.25 180 top
R35  100K  [R0603]  24.32 31.1 0 top
R36  22k  [R0603]  14.81 25.8 0 top
R37  10K  [R0603]  24.32 26.15 0 top
R38  220  [R0603]  6.35 22.59 0 bottom
R39  220  [R0603]  24.32 24.5 0 top
R40  47K  [R0603]  14.84 24.04 180 top
R41  100K  [R0603]  24.32 22.77 0 top
R42  22k  [R0603]  14.86 16.62 0 top
R43  10K  [R0603]  24.32 16.74 0 top
R44  220  [R0603]  6.48 13.83 0 bottom
R45  220  [R0603]  24.32 15.14 0 top
R46  47K  [R0603]  14.84 14.85 180 top
R47  100K  [R0603]  24.32 13.45 0 top
R48  330  [R0603]  6.48 15.48 0 bottom
R49  330  [R0603]  6.35 24.24 0 bottom
R50  330  [R0603]  6.48 32.88 0 bottom
R51  330  [R0603]  6.22 41.9 0 bottom
R52  330  [R0603]  6.35 50.91 0 bottom
R53  330  [R0603]  6.35 60.19 0 bottom
R54  2.2K  [R0603]  39.5 53.84 180 top
R55  2.2K  [R0603]  39.5 45.2 180 top
R57  2.2K  [R0603]  39.5 36.44 180 top
R58  2.2K  [R0603]  39.5 27.67 180 top
R59  2.2K  [R0603]  39.5 18.78 180 top
R60  2.2K  [R0603]  39.5 10.02 180 top
R62  4.7k  [R0603]  6.35 61.84 0 bottom
R63  4.7k  [R0603]  6.35 52.57 0 bottom
R64  4.7k  [R0603]  6.22 43.55 0 bottom
R65  4.7k  [R0603]  6.48 34.53 0 bottom
R66  4.7k  [R0603]  6.35 25.9 0 bottom
R67  4.7k  [R0603]  6.48 17.13 0 bottom
U1  KF128-3.81-2P  [CONN-TH_2P-P3.81_KF128-3.81-2P]  3.68 86.6 270 top
U2  PC817C  [OPTO-SMD-4_L4.6-W6.5-P2.54-LS10.3-TL]  15.01 92.14 180 top
U3  1N4007 A7  [SOD-123FL_L2.7-W1.8-LS3.8-RD]  31.37 89.65 0 top
U4  KF128-3.81-2P  [CONN-TH_2P-P3.81_KF128-3.81-2P]  45.42 86.6 90 top
U5  PC817C  [OPTO-SMD-4_L4.6-W6.5-P2.54-LS10.3-TL]  15.01 83.89 180 top
U6  1N4007 A7  [SOD-123FL_L2.7-W1.8-LS3.8-RD]  31.5 81.01 0 top
U7  KF128-3.81-2P  [CONN-TH_2P-P3.81_KF128-3.81-2P]  45.42 78.73 90 top
U8  PC817C  [OPTO-SMD-4_L4.6-W6.5-P2.54-LS10.3-TL]  15.01 75.38 180 top
U9  1N4007 A7  [SOD-123FL_L2.7-W1.8-LS3.8-RD]  31.37 72.63 0 top
U10  KF128-3.81-2P  [CONN-TH_2P-P3.81_KF128-3.81-2P]  45.42 70.85 90 top
U11  2N3904S(ZC)NPN  [SOT-23-3_L2.9-W1.3-P0.95-LS2.4-BR]  24.38 67.42 270 top
U12  KF128-3.81-2P  [CONN-TH_2P-P3.81_KF128-3.81-2P]  36.58 3.54 0 top
U13  PC817C  [OPTO-SMD-4_L4.6-W6.5-P2.54-LS10.3-TL]  7.49 66.41 0 top
U14  2N3904S(ZC)NPN  [SOT-23-3_L2.9-W1.3-P0.95-LS2.4-BR]  28.19 67.42 270 top
U15  KF128-3.81-2P  [CONN-TH_2P-P3.81_KF128-3.81-2P]  45.42 57.14 90 top
U16  PC817C  [OPTO-SMD-4_L4.6-W6.5-P2.54-LS10.3-TL]  7.49 55.61 0 top
U17  TPH1R403NL  [DFN-8_L5.0-W5.0-P1.27-LS6.0-EP]  36.88 58.28 270 top
U18  2N3904S(ZC)NPN  [SOT-23-3_L2.9-W1.3-P0.95-LS2.4-BR]  20.07 59.31 270 top
U19  KF128-3.81-2P  [CONN-TH_2P-P3.81_KF128-3.81-2P]  45.34 48.37 90 top
U20  PC817C  [OPTO-SMD-4_L4.6-W6.5-P2.54-LS10.3-TL]  7.49 46.72 0 top
U21  TPH1R403NL  [DFN-8_L5.0-W5.0-P1.27-LS6.0-EP]  36.88 49.83 270 top
U22  2N3904S(ZC)NPN  [SOT-23-3_L2.9-W1.3-P0.95-LS2.4-BR]  20.07 50.03 270 top
U23  KF128-3.81-2P  [CONN-TH_2P-P3.81_KF128-3.81-2P]  45.34 39.74 90 top
U24  PC817C  [OPTO-SMD-4_L4.6-W6.5-P2.54-LS10.3-TL]  7.49 37.96 0 top
U25  TPH1R403NL  [DFN-8_L5.0-W5.0-P1.27-LS6.0-EP]  36.88 40.88 270 top
U26  2N3904S(ZC)NPN  [SOT-23-3_L2.9-W1.3-P0.95-LS2.4-BR]  20.07 41.26 270 top
U27  KF128-3.81-2P  [CONN-TH_2P-P3.81_KF128-3.81-2P]  45.47 30.85 90 top
U28  PC817C  [OPTO-SMD-4_L4.6-W6.5-P2.54-LS10.3-TL]  7.49 29.16 0 top
U29  TPH1R403NL  [DFN-8_L5.0-W5.0-P1.27-LS6.0-EP]  36.88 32.12 270 top
U30  2N3904S(ZC)NPN  [SOT-23-3_L2.9-W1.3-P0.95-LS2.4-BR]  20.07 32.63 270 top
U31  KF128-3.81-2P  [CONN-TH_2P-P3.81_KF128-3.81-2P]  45.34 22.09 90 top
U32  PC817C  [OPTO-SMD-4_L4.6-W6.5-P2.54-LS10.3-TL]  7.49 20.4 0 top
U33  TPH1R403NL  [DFN-8_L5.0-W5.0-P1.27-LS6.0-EP]  36.88 23.31 270 top
U34  2N3904S(ZC)NPN  [SOT-23-3_L2.9-W1.3-P0.95-LS2.4-BR]  20.07 24.37 270 top
U35  KF128-3.81-2P  [CONN-TH_2P-P3.81_KF128-3.81-2P]  45.34 13.2 90 top
U36  PC817C  [OPTO-SMD-4_L4.6-W6.5-P2.54-LS10.3-TL]  7.49 11.51 0 top
U37  TPH1R403NL  [DFN-8_L5.0-W5.0-P1.27-LS6.0-EP]  36.88 14.76 270 top
U38  2N3904S(ZC)NPN  [SOT-23-3_L2.9-W1.3-P0.95-LS2.4-BR]  20.07 15.23 270 top
U39  2N3904S(ZC)NPN  [SOT-23-3_L2.9-W1.3-P0.95-LS2.4-BR]  8.25 60.57 270 top
U40  2N3904S(ZC)NPN  [SOT-23-3_L2.9-W1.3-P0.95-LS2.4-BR]  8.25 51.04 270 top
U41  2N3904S(ZC)NPN  [SOT-23-3_L2.9-W1.3-P0.95-LS2.4-BR]  8.25 42.41 270 top
U42  2N3904S(ZC)NPN  [SOT-23-3_L2.9-W1.3-P0.95-LS2.4-BR]  8.25 33.52 270 top
U43  2N3904S(ZC)NPN  [SOT-23-3_L2.9-W1.3-P0.95-LS2.4-BR]  8.25 24.88 270 top
U44  2N3904S(ZC)NPN  [SOT-23-3_L2.9-W1.3-P0.95-LS2.4-BR]  8.25 16.12 270 top
U45  AMS1117-3.3  [SOT-223-3_L6.5-W3.4-P2.30-LS7.0-BR]  15.11 88.76 270 bottom
U47  AMS1117-5.0  [SOT-223_L6.5-W3.5-P2.30-LS7.0-BR]  29.34 88.89 270 bottom
ZD1  ZM4744A  [LL-41_L5.0-W2.5-LS5.0-RD]  29.46 58.15 90 top
ZD2  ZM4744A  [LL-41_L5.0-W2.5-LS5.0-RD]  29.46 49.64 90 top
ZD3  ZM4744A  [LL-41_L5.0-W2.5-LS5.0-RD]  29.46 40.5 90 top
ZD4  ZM4744A  [LL-41_L5.0-W2.5-LS5.0-RD]  29.46 31.99 90 top
ZD5  ZM4744A  [LL-41_L5.0-W2.5-LS5.0-RD]  29.46 23.36 90 top
ZD6  ZM4744A  [LL-41_L5.0-W2.5-LS5.0-RD]  29.46 14.59 90 top

## Footprints (pads in the part's own frame, mm; a bottom-side part is the same pattern mirrored in y, then rotated)
C0603
  rect 0.8x0.9 smd: 1(-0.7,0) 2(0.7,0)
CAP-TH_BD6.3-P2.50-D0.5-FD
  round 1.5 hole 0.9: 1(-1.25,0) 2(1.25,0)
CONN-TH_2P-P3.81_KF128-3.81-2P
  round 2.5 hole 1.3: 1(-1.905,0) 2(1.905,0)
DFN-8_L5.0-W5.0-P1.27-LS6.0-EP
  rect 0.65x1.2 smd: 1(-1.955,-2.7) 2(-0.685,-2.7) 3(0.585,-2.7) 4(1.855,-2.7)
  rect 0.65x1 smd: 5(1.855,2.7) 6(0.585,2.7) 7(-0.685,2.7) 8(-1.955,2.7)
  rect 1x0.5 smd: 8(-2.35,0.001) 8(2.35,0.001)
  rect 4.25x4 smd: 8(-0.05,0.55)
HDR-TH_3P-P2.54-V-M
  rect 1.7x1.7 hole 1.1: 1(-2.54,0)
  round 1.7 hole 1.1: 2(0,0) 3(2.54,0)
HDR-TH_8P-P2.54-V-M
  rect 1.5x1.5 hole 1: 1(-8.89,0)
  round 1.5 hole 1: 2(-6.35,0) 3(-3.81,0) 4(-1.27,0) 5(1.27,0) 6(3.81,0) 7(6.35,0) 8(8.89,0)
LED_0603
  rect 0.8x0.8 smd: 1(-0.851,-0.01) 2(0.75,-0.005)
LL-41_L5.0-W2.5-LS5.0-RD
  rect 1.335x2.646 smd: 1(2.567,0) 2(-2.567,0)
OPTO-SMD-4_L4.6-W6.5-P2.54-LS10.3-TL
  rect 2.5x1.5 smd: 1(-4.3,1.27) 2(-4.3,-1.27) 3(4.3,-1.27) 4(4.3,1.27)
R0603
  rect 0.806x0.864 smd: 1(-0.753,0) 2(0.753,0)
SMB_L4.6-W3.6-LS5.3-BI
  rect 2.047x2.241 smd: 1(-2.591,0) 2(2.591,0)
SOD-123_L2.8-W1.8-LS3.7-RD
  rect 0.95x1.15 smd: 1(-1.692,0) 2(1.692,0)
SOD-123FL_L2.7-W1.8-LS3.8-RD
  rect 1.4x1.2 smd: 1(-1.735,0) 2(1.735,0)
SOT-23-3_L2.9-W1.3-P0.95-LS2.4-BR
  rect 1.25x0.7 smd: 1(1,-0.95) 2(1,0.95) 3(-1,0)
SOT-223-3_L6.5-W3.4-P2.30-LS7.0-BR
  rect 2.5x1.1 smd: 1(2.97,-2.3) 2(2.97,0) 3(2.97,2.3)
  rect 2.34x3.6 smd: 4(-2.97,0)
SOT-223_L6.5-W3.5-P2.30-LS7.0-BR
  rect 2.465x1.05 smd: 1(2.857,-2.3) 2(2.857,0) 3(2.857,2.3)
  rect 2.465x3.54 smd: 4(-2.857,0)

## Nets
As in the schematic.

## Via types
v1: diameter 0.61, hole 0.305, Top Layer to Bottom Layer, 219 vias

## Routing (per net, layer and track width the routed paths; a pad name or vN(x,y) marks a point on that pad's centre or on a via; arc(x,y) is an arc through that point)
3V3: length 105.6
  Top Layer w0.254: R1.1 R3.1 R5.1 5.46,73.89 5.46,64 3.82,62.36 LED9.2 5.59,58.43 5.59,53.71 3.82,51.94 3.82,51.05 v1(5.59,49.28) 5.59,44.95 3.82,43.18 LED7.2 5.46,40.39 5.46,36.18 3.81,34.53 3.81,33.15 v1(5.72,31.25) 5.72,27.8 3.81,25.9 3.81,25.64 3.82,25.63 LED5.2 5.59,22.48 5.59,18.4 3.81,16.62 3.81,15.63 v1(5.59,13.85) 5.59,13.83
  Top Layer w0.5: v1(5.34,90.28) 5.34,79.5 5.47,79.36 R1.1
  Bottom Layer w0.254: C5.2 15.43,85.47 U45.2
  Bottom Layer w0.5: v1(5.34,90.28) 5.34,91.56 6.1,92.32 v1(6.48,92.32) 14.53,92.32 15.11,91.73
  Bottom Layer w1: U45.2 15.11,91.73
  vias: v1(5.42,40.26) v1(5.55,58.53) v1(5.55,22.7)
5V: length 35.5
  Bottom Layer w0.254: C7.2 29.78,85.59 U47.2 U47.4
  Bottom Layer w0.5: v1(5.41,93.46) 5.46,93.51 5.46,94.88 5.64,95.06 26.02,95.06 U47.4
12V+: length 172.1
  Top Layer w0.254: 25.07,42.79 24.31,43.55 16.51,43.55 ; v1(42.12,54.09) 41.87,53.84 R54.1 ; R31.2 24.31,35.29 17.01,35.29 16.38,34.67 ; R37.2 25.07,26.15 24.82,26.4 24.82,27.06 24.64,27.24 17,27.24 16.26,26.5 ; v1(42.04,36.69) 41.78,36.44 R57.1 ; 16.51,43.55 16.26,43.8 16.26,47.21 14.86,48.61 14.86,50.28 15.37,50.79 R18.2 16.64,51.81 16.64,51.93 ; 16.51,43.55 15.61,42.65 R24.2 14.86,41.6 14.86,39.99 16.38,38.47 16.38,34.67 ; 16.56,61 16.89,61.33 24.33,61.33 R13.2 ; 16.56,61 15.81,60.25 15.81,60.2 R12.2 14.93,59.52 14.93,58.82 14.93,58.82 14.93,57.72 14.93,57.72 14.93,57.32 16.26,55.99 16.26,52.31 16.64,51.93 ; 16.56,61 16.31,61.25 16.31,65.09 16.13,65.27 15.11,65.27 14.85,65.53 14.85,66.41 14.79,66.47 14.79,66.86 14.85,66.92 14.85,68.06 15.36,68.57 R8.2 R7.2 ; R60.1 41.91,10.02 v1(42.04,10.15) ; v1(42.04,45.33) 41.91,45.2 R55.1 ; R19.2 23.89,51.93 16.64,51.93 ; 16.76,17.77 24.05,17.77 25.02,16.8 ; 16.76,17.77 16.26,18.28 16.26,21.96 14.91,23.3 14.91,25.15 R36.2 16.26,26.5 16.26,29.83 14.86,31.23 14.86,33.26 15.49,33.9 R30.2 16.38,34.67 ; 16.76,17.77 R42.2 ; 25.02,16.8 R43.2 ; 25.02,16.8 v1(25.02,17.77) ; R58.1 42.04,27.67 v1(42.16,27.8) ; v1(42.04,19.04) 41.78,18.78 R59.1
  Top Layer w0.5: 38.99,3.04 36.96,1 29.34,1 27.86,2.48 27.81,2.48 v1(27.76,2.53) ; U12.2 38.48,3.04
  Bottom Layer w0.254: v1(27.76,2.53) 27.76,4.05 26.52,5.29 26.52,17.59 26.34,17.77 v1(25.02,17.77)
  Bottom Layer w2: 39.07,55.64 39.07,61.27 C4.1
  vias: v1(38.86,6.59) v1(38.86,5.58) v1(40.02,6.59) v1(40.01,5.58) v1(41.28,7.48) v1(41.31,6.59) v1(41.31,5.56) v1(41.28,4.66) v1(42.04,47.36) v1(42.04,46.34) v1(42.04,38.72) v1(42.04,37.71) v1(42.04,21.07) v1(42.04,20.05) v1(42.04,12.18) v1(42.04,11.16) v1(42.12,55.11) v1(42.16,56.12) v1(42.16,29.83) v1(42.16,28.82) v1(42.97,47.36) v1(42.97,46.34) v1(42.97,45.33) v1(42.97,38.72) v1(42.97,37.71) v1(42.97,36.69) v1(42.97,21.07) v1(42.97,20.05) v1(42.97,19.04) v1(42.97,12.18) v1(42.97,11.16) v1(42.97,10.15) v1(43.06,56.12) v1(43.06,55.11) v1(43.06,54.09) v1(43.1,29.83) v1(43.1,28.82) v1(43.1,27.8)
12V-: length 169.1
  Top Layer w0.254: 11.79,27.89 12.79,27.89 v1(12.83,27.93) ; 21.02,31.5 23.17,31.5 R35.1 28.75,25.92 ZD5.1 ; v1(12.83,45.33) 12.7,45.45 U20.3 ; U11.2 25.33,69.01 25.78,69.46 29.21,69.46 29.46,69.2 ZD1.1 ; U22.2 22.03,49.03 R23.1 27.99,43.07 ZD3.1 ; U18.2 22.4,58.31 R17.1 23.88,56.83 v1(23.88,56.63) ; v1(12.83,19.04) 12.73,19.13 U32.3 ; ZD6.1 29.17,17.16 R41.1 22.96,23.37 U34.2 ; v1(12.95,10.28) 11.83,10.28 U36.3 26.74,10.24 26.76,10.26 R47.1 22.79,14.23 U38.2 ; U16.3 v1(12.83,54.34) ; ZD4.1 28.33,34.56 R29.1 22.62,40.26 U26.2 ; U13.3 v1(12.83,65.14)
  Top Layer w0.75: 28.07,10.26 29.99,10.26 v1(29.97,10.28) ; 28.07,10.26 28.07,10.26 ; 28.07,10.26 26.92,10.26
  Bottom Layer w0.254: v1(12.95,10.28) 12.83,10.4 v1(12.83,19.04) v1(12.83,27.93) v1(12.83,36.68) v1(12.83,45.33) v1(12.83,54.34) v1(12.83,65.14) ; v1(28.32,60.19) 24.76,56.63 v1(23.88,56.63) ; D4.1 30.95,7.41 v1(31.77,6.59)
  Bottom Layer w2: v1(31.5,60.82) 31.5,65.37 33.02,66.9 C4.2
  vias: v1(31.5,60.06) v1(31.5,52.44) v1(31.5,51.68) v1(31.5,43.29) v1(31.5,42.53) v1(31.5,25.77) v1(31.5,25.01) v1(31.5,17.26) v1(31.5,16.5) v1(31.62,34.79) v1(31.62,34.02) v1(31.75,5.58) v1(31.88,59.17) v1(31.88,58.15) v1(31.88,50.79) v1(31.88,49.77) v1(31.88,41.64) v1(31.88,40.63) v1(31.88,24.12) v1(31.88,23.1) v1(31.88,15.61) v1(31.88,14.59) v1(32,33.13) v1(32,32.12) v1(32.3,60.82) v1(32.28,60.06) v1(32.3,52.44) v1(32.28,51.68) v1(32.3,43.29) v1(32.28,42.53) v1(32.3,25.77) v1(32.28,25.01) v1(32.3,17.26) v1(32.28,16.5) v1(32.43,34.79) v1(32.41,34.02) v1(32.71,59.17) v1(32.71,58.15) v1(32.71,50.79) v1(32.71,49.77) v1(32.71,41.64) v1(32.71,40.63) v1(32.71,24.12) v1(32.71,23.1) v1(32.71,15.61) v1(32.71,14.59) v1(32.84,33.13) v1(32.84,32.12) v1(33.07,60.82) v1(33.07,60.06) v1(33.07,52.44) v1(33.07,51.68) v1(33.07,43.29) v1(33.07,42.53) v1(33.07,25.77) v1(33.07,25.01) v1(33.07,17.26) v1(33.07,16.5) v1(33.06,6.59) v1(33.06,5.56) v1(33.2,34.79) v1(33.2,34.02) v1(34.16,6.59) v1(34.16,5.54)
GND: length 154.7
  Top Layer w0.254: U2.3 10.05,92.75 8.43,92.75 8.25,92.57 8.25,84.84 8.24,84.82 8.24,84.7 ; U5.3 10.25,84.7 v1(8.25,84.7) 8.25,84.82 ; H3.1 7.49,10.4 9.14,12.05 9.14,15.06 U44.2 U43.2 U42.2 U41.2 U40.2 U39.2 9.14,59.63 v1(9.14,65.12) 9.14,68.57 8.25,69.46 8.25,74.92 9.99,76.65 U8.3
  Top Layer w0.5: v1(8.25,84.7) 8.25,80.89 10.71,78.43 U8.3
  Bottom Layer w0.254: v1(3.19,65.14) 9.13,65.14 v1(9.14,65.12) ; 7.49,1.38 7.49,4.18 ; U47.1 31.64,83.67 C7.1 31.19,83.21 C8.1 ; 16.83,80.63 16.83,81.27 16.85,81.29 16.85,83.15 16.83,83.17 17.41,83.76 U45.1
  Bottom Layer w0.5: 32.64,85.03 32.64,79.87 32.46,79.69 17.77,79.69 16.83,80.63 16.83,80.19 13.84,77.2 v1(10.79,77.2) ; 32.64,85.03 35.18,85.03 ; 32.64,85.03 U47.1 ; U1.2 v1(8.25,84.7)
VIN: length 36.3
  Top Layer w0.5: v1(15.24,80.63) v1(18.8,80.63)
  Bottom Layer w0.254: C6.2 v1(15.24,80.63)
  Bottom Layer w0.5: C8.2 27.04,83.41 ; 27.04,83.41 24.26,80.63 v1(18.8,80.63) ; 27.04,83.41 27.04,86.03 ; 12.83,85.78 12.83,82.66 14.86,80.63 v1(15.24,80.63) ; U45.3 12,86.6 6.73,86.6 4.83,88.51 U1.1
EN: length 78.3
  Top Layer w0.254: v1(1.09,70.47) 2.29,70.47 R10.1
  Bottom Layer w0.254: 0.96,7.56 0.96,60.84 1.09,60.97 v1(1.09,70.47) ; 0.94,7.56 3.03,5.46 9.64,5.46 10.03,5.07 H3.2 10.03,1.38
EN_OUT: length 4.1
  Top Layer w0.254: v1(28.57,68.44) 28.52,68.5 28.27,68.5 U14.3
  Bottom Layer w0.254: v1(28.57,68.44) 31.5,70.73
GATE1: length 12.1
  Top Layer w0.254: R15.2 R17.2 25.07,56.7 25.91,55.87 29.18,55.87 ZD1.2 33.34,55.59 U17.4
GATE2: length 11.2
  Top Layer w0.254: R21.2 R23.2 29.06,47.49 ZD2.2 33.28,47.08 U21.4
GATE3: length 11.8
  Top Layer w0.254: R27.2 R29.2 28.08,39.32 ZD3.2 33.09,37.93 U25.4
GATE4: length 11.9
  Top Layer w0.254: R33.2 R35.2 27.79,31.1 ZD4.2 33.34,29.42 U29.4
GATE5: length 11.9
  Top Layer w0.254: U33.4 33.51,20.79 ZD5.2 27.49,22.77 R41.2 R39.2
GATE6: length 11.7
  Top Layer w0.254: R45.2 R47.2 28.04,13.45 ZD6.2 33.3,12.03 U37.4
L1-OUT-: length 2.6
  Top Layer w0.254: LED10.1 36.88,54.96 U17.8
  vias: v1(35.81,53.84) v1(43.94,60.82) v1(43.94,60.06) v1(44.83,60.82) v1(45.72,60.82) v1(46.61,60.82)
L1-VIN+: length 20.7
  Top Layer w0.254: 33.66,89.65 33.91,89.4
  Top Layer w0.762: 28.78,93.59 32.71,89.65 33.57,89.65
  Top Layer w1.016: U4.1 40.47,89.65 33.57,89.65
L1-VIN-: length 29.8
  Top Layer w0.254: 22.48,93.25 22.48,93.71 23.5,94.73 32.82,94.73 33.96,93.59 ; 22.48,93.25 22.31,93.41 U2.2 ; 22.48,93.25 C1.1
  Top Layer w1.016: U4.2 40.34,93.59 33.96,93.59
L2-OUT-: length 2.8
  Top Layer w0.254: U21.8 36.88,46.33 LED11.1
  vias: v1(35.69,45.2) v1(43.86,52.06) v1(43.86,51.3) v1(44.75,52.06) v1(45.64,52.06) v1(46.53,52.06)
L2-VIN+: length 21
  Top Layer w0.254: 33.78,81.01 34.16,80.63
  Top Layer w0.762: 28.78,85.46 29.34,85.46 33.78,81.01
  Top Layer w1.016: U7.1 41.23,81.01 33.57,81.01
L2-VIN-: length 29.7
  Top Layer w0.254: U5.2 19.45,85.3 C2.1 22.59,85.57 23.88,86.86 32.18,86.86 D2.1
  Top Layer w1.016: 33.96,85.46 40.6,85.46 U7.2
L3-OUT-: length 2.7
  Top Layer w0.254: U25.8 36.88,37.75 35.81,36.69 v1(35.81,36.31)
  vias: v1(43.94,43.17) v1(43.94,42.41) v1(44.83,43.17) v1(45.72,43.17) v1(46.61,43.17)
L3-VIN+: length 20
  Top Layer w0.762: 33.57,72.63 33.1,72.63 28.78,76.95
  Top Layer w1.016: 33.57,72.63 41.74,72.63 U10.1
L3-VIN-: length 30
  Top Layer w0.254: U8.2 19.37,76.7 C3.1 22.59,78.07 22.86,78.35 32.31,78.35 D3.1
  Top Layer w1.016: 33.96,76.95 41.23,76.95 U10.2
L4-OUT-: length 2.6
  Top Layer w0.254: U29.8 36.88,28.87 LED14.1
  vias: v1(35.69,27.67) v1(43.99,34.53) v1(43.99,33.77) v1(44.88,34.53) v1(45.76,34.53) v1(46.65,34.53)
L5-OUT-: length 2.8
  Top Layer w0.254: 35.68,18.66 35.67,18.65 ; 35.68,18.66 36.88,19.86 U33.8 ; 35.68,18.66 v1(35.69,18.66)
  vias: v1(43.86,25.77) v1(43.86,25.01) v1(44.75,25.77) v1(45.64,25.77) v1(46.53,25.77)
L6-OUT-: length 2.9
  Top Layer w0.254: 35.74,9.95 35.74,10.07 36.88,11.21 U37.8
  vias: v1(35.69,9.89) v1(43.86,16.88) v1(43.86,16.12) v1(44.75,16.88) v1(45.64,16.88) v1(46.53,16.88)
LINE_1: length 74
  Bottom Layer w0.254: 1.32,7.71 1.32,60.69 2.46,61.84 R62.1 ; 12.57,1.38 H3.3 12.57,5.56 12.32,5.82 3.19,5.82 1.32,7.69
LINE_2: length 66.6
  Bottom Layer w0.254: 1.68,7.84 3.34,6.17 14.82,6.17 15.11,5.88 H3.4 15.11,1.38 ; R63.1 2.92,52.57 1.68,51.32 1.68,7.85
LINE_3: length 59.6
  Bottom Layer w0.254: R64.1 2.92,43.55 2.03,42.66 2.03,7.98 3.49,6.53 17.27,6.53 17.65,6.15 H3.5 17.65,1.38
LINE_4: length 53
  Bottom Layer w0.254: 20.19,1.38 H3.6 20.19,6.49 19.8,6.89 3.63,6.89 2.44,8.08 2.44,34.18 2.79,34.53 R65.1
LINE_5: length 46
  Bottom Layer w0.254: R66.1 3.56,25.9 2.79,25.13 2.79,8.23 3.78,7.24 22.34,7.24 22.73,6.85 H3.7 22.73,1.38
LINE_6: length 39.3
  Bottom Layer w0.254: 3.17,8.37 3.17,16.5 3.81,17.13 R67.1 ; 3.17,8.35 3.93,7.6 24.9,7.6 25.27,7.23 H3.8 25.27,1.38
LINE_PC817_2_1: length 11.7
  Bottom Layer w0.254: v1(3.81,54.34) 5.97,54.34 8.25,56.63 v1(8.25,61.33) 7.11,60.19 R53.2
LINE_PC817_2_2: length 11.4
  Bottom Layer w0.254: 8.13,51.8 7.24,50.91 R52.2 ; 8.13,51.8 v1(8.25,51.93) 8.25,47.74 5.97,45.45 v1(3.81,45.45) ; 8.13,51.8 8.13,51.91 U40.3
LINE_PC817_2_3: length 11.8
  Bottom Layer w0.254: U41.3 v1(8.25,43.42) ; U41.3 8.13,43.28 8.13,43.05 R51.2 ; U41.3 8.25,39.1 5.84,36.69 v1(3.81,36.69)
LINE_PC817_2_4: length 11.6
  Bottom Layer w0.254: R50.2 8.13,33.78 8.13,34.39 U42.3 ; v1(8.25,34.28) 8.25,30.09 6.1,27.93 v1(3.81,27.93)
LINE_PC817_2_5: length 11.5
  Bottom Layer w0.254: v1(3.81,19.16) 5.97,19.16 8.25,21.45 v1(8.25,25.64) 8.13,25.51 8.13,25.27 R49.2
LINE_PC817_2_6: length 11.3
  Bottom Layer w0.254: v1(3.81,10.28) 5.97,10.28 8.25,12.56 v1(8.25,16.75) 8.13,16.62 8.13,16.38 R48.2
$1N3555: length 8.9
  Top Layer w0.254: 20.45,55.22 20.45,56.5 20.07,56.88 U18.3 20.34,60.58 R13.1
$1N3692: length 3.5
  Top Layer w0.254: U18.1 19.08,58.27 R16.1
$1N3696: length 8.7
  Top Layer w0.254: R16.2 12.72,56.88 U16.4 ; R16.2 14.11,55.87 14.76,55.22 15.37,55.22 ; R16.2 R12.1
$1N3855: length 7
  Bottom Layer w0.254: v1(23.24,59.3) 21.99,59.3 17.91,55.22
$1N6078: length 7.6
  Top Layer w0.254: U13.4 12.68,68.57 R8.1 R9.1 14.11,65.38 15.37,64.12
$1N6285: length 7.9
  Top Layer w0.254: U11.1 v1(21.59,66.42) ; R9.2 15.87,66.41 v1(18.16,66.41)
  Bottom Layer w0.254: v1(18.16,66.41) 18.18,66.42 v1(21.59,66.42)
$1N6498: length 8.7
  Top Layer w0.254: 20.45,64.12 20.46,64.13 R7.1 24.53,68.57 U11.3
$1N7595: length 3.6
  Top Layer w0.254: R22.1 18.99,49.15 U22.1
$1N7596: length 8.4
  Top Layer w0.254: R19.1 23.29,51.03 U22.3 20.07,47.74 20.32,47.49 20.32,46.33
$1N7601: length 8
  Top Layer w0.254: U20.4 12.95,47.99 R22.2 ; 15.24,46.33 14.76,46.33 14.11,46.98 R22.2 ; R22.2 R18.1
$1N7602: length 6.7
  Bottom Layer w0.254: 17.78,46.33 20.84,49.39 v1(23.24,49.39)
$1N7603: length 3.8
  Bottom Layer w0.254: v1(3.81,47.99) 5.83,47.99 R20.2
$1N10434: length 8.5
  Top Layer w0.254: R28.2 12.75,39.23 U24.4 ; R28.2 14.11,38.22 14.1,38.21 14.1,37.96 14.62,37.44 15.11,37.44 ; R28.2 R24.1
$1N10443: length 8.6
  Top Layer w0.254: 23.57,42.79 20.59,42.79 U26.3 20.19,42.14 20.19,37.44
$1N10444: length 7.7
  Bottom Layer w0.254: v1(23.24,41.26) 20.57,41.26 17.65,38.34 17.65,37.44
$1N10445: length 3.6
  Top Layer w0.254: R28.1 18.79,40.59 U26.1
$1N10701: length 9.6
  Top Layer w0.254: 17.91,64.12 19.43,62.6 24.26,62.6 26.03,64.38 R11.2
$1N10706: length 2.7
  Top Layer w0.254: R11.1 27.56,64.51 27.56,66.59 27.41,66.59 U14.1
$1N10712: length 2.9
  Top Layer w0.254: R10.2 4.06,68.54 U13.1
$1N13584: length 8.5
  Top Layer w0.254: R37.1 22.79,25.37 U34.3 20.07,21.36 20.56,20.86
$1N13585: length 9.2
  Top Layer w0.254: R40.2 14.22,23.9 14.22,21.45 14.81,20.86 15.48,20.86 ; R40.2 11.79,21.74 U32.4 ; R40.2 14.09,25.77 R36.1
$1N13586: length 7
  Bottom Layer w0.254: v1(23.24,24.88) 21.84,24.88 18.02,21.06 18.02,20.86
$1N13593: length 3.8
  Top Layer w0.254: R46.1 18.5,14.85 U38.1
$1N13594: length 8.6
  Top Layer w0.254: 15.24,11.67 14.09,12.82 R46.2 ; U36.4 12.02,12.78 R46.2 ; R46.2 14.11,14.87 R42.1
$1N13599: length 8.4
  Top Layer w0.254: 20.32,11.67 20.07,11.93 U38.3 23.05,16.23 R43.1
$1N13600: length 7.4
  Top Layer w0.254: v1(23.24,15.48) 23.57,15.16 R45.1
  Bottom Layer w0.254: 17.91,11.67 21.72,15.48 v1(23.24,15.48)
$1N13602: length 3.8
  Top Layer w0.254: U34.1 18.45,24.04 R40.1
$1N13606: length 8.4
  Top Layer w0.254: R31.1 22.54,33.5 20.07,33.5 ; 20.07,33.5 H7.1 ; 20.07,33.5 U30.3
$1N13609: length 8.1
  Top Layer w0.254: R34.2 14.11,30.08 H7.3 ; R34.2 R30.1 ; R34.2 12.29,30.43 U28.4
$1N13610: length 3.8
  Top Layer w0.254: U30.1 18.5,32.25 R34.1
$1N13611: length 7.4
  Bottom Layer w0.254: v1(23.24,33.26) 21.59,33.26 H7.2
$1N16915:
  vias: v1(5.6,60.19)
$1N19054: length 1.4
  Top Layer w0.254: R54.2 38.73,53.83 37.34,53.83
$1N19258: length 1.4
  Top Layer w0.254: 37.34,45.2 R55.2
$1N19424: length 1.6
  Top Layer w0.254: 38.74,36.18 38.62,36.18 38.36,36.44 37.73,36.44 37.46,36.17 37.34,36.17
$1N19558: length 1.5
  Top Layer w0.254: LED14.2 R58.2
$1N19703: length 1.5
  Top Layer w0.254: 37.27,18.66 38.74,18.66
$1N19842: length 1.4
  Top Layer w0.254: R60.2 37.4,10.02 37.34,9.96
$1N28737: length 2.3
  Top Layer w0.254: U39.1 7.31,61.64 v1(7.11,61.84)
$1N28922: length 4
  Bottom Layer w0.254: R14.2 5.45,56.88 v1(3.81,56.88)
$1N28949:
  vias: v1(5.6,50.91)
$1N29020: length 2.6
  Top Layer w0.254: v1(7.24,52.57) 7.31,52.5 U40.1
$1N29206: length 3.6
  Bottom Layer w0.254: R26.2 5.96,39.23 v1(3.81,39.23)
$1N29280:
  vias: v1(5.47,41.9)
$1N29286: length 2.1
  Top Layer w0.254: v1(6.98,43.42) 7.31,43.1 U41.1
$1N29399: length 2
  Top Layer w0.254: U42.1 v1(7.31,34.53)
$1N29408:
  vias: v1(5.68,32.88)
$1N29418: length 3.7
  Bottom Layer w0.254: R32.2 6.47,30.47 v1(3.81,30.47)
$1N29537: length 3.7
  Bottom Layer w0.254: R38.2 6.09,21.58 v1(3.81,21.58)
$1N29548:
  vias: v1(5.55,24.24)
$1N29553: length 1.9
  Top Layer w0.254: U43.1 7.31,25.7 v1(7.24,25.77)
$1N29675: length 2
  Top Layer w0.254: U44.1 7.37,15.18 v1(7.37,17.13)
$1N29685:
  vias: v1(5.68,15.48)
$1N29695: length 3.8
  Bottom Layer w0.254: R44.2 6.21,12.81 v1(3.81,12.81)
$2N821: length 7.9
  Top Layer w0.254: 29.17,89.4 27.37,91.19 R2.2 23.99,91.21 C1.2
$2N826: length 21.7
  Top Layer w0.254: U2.4 10.71,87.83 12.45,86.09 12.45,81.65 11.56,80.76 v1(9.53,80.76)
  Bottom Layer w0.254: H1.3 v1(7.11,79.11) 7.87,79.11 v1(9.53,80.76)
$2N829: length 3.8
  Top Layer w0.254: LED1.1 20.67,90.87 U2.1
$2N830: length 2.7
  Top Layer w0.254: LED1.2 24.01,89.64 R2.1
$2N833: length 8.2
  Top Layer w0.254: 29.3,81.14 27.17,83.27 R4.2 23.99,83.29 C2.2
$2N834: length 13.3
  Bottom Layer w0.254: v1(10.48,82.35) 10.48,78.54 8.64,76.7 v1(6.89,76.7) 1.91,76.7 H1.2
$2N837: length 3.7
  Top Layer w0.254: U5.1 20.9,82.62 LED2.1
$2N838: length 2.8
  Top Layer w0.254: R4.1 23.99,81.74 LED2.2
$2N841: length 8.2
  Top Layer w0.254: 29.17,72.63 27.36,74.44 23.99,74.44 ; 23.99,74.44 R6.2 ; 23.99,74.44 C3.2
$2N842: length 7.9
  Bottom Layer w0.254: H1.1 v1(7.06,74.03) v1(9.65,74.03)
$2N845: length 4.2
  Top Layer w0.254: 22.77,72.38 22.48,72.38 20.75,74.11 U8.1
$2N846: length 2.8
  Top Layer w0.254: R6.1 24.37,72.51 24.37,72.38

## Copper pours and planes (outline as drawn; the poured copper is in the pictures)
3V3 on Bottom Layer: 8.13,94.35 20.45,94.35 20.45,87.36 8.13,87.36
5V on Bottom Layer: 23.56,94.41 37.02,94.41 37.02,87.43 23.56,87.43
12V+ on Top Layer: 43.18,1.64 36.95,1.64 36.95,5.25 41.72,10.02 43.18,10.02
12V+ on Top Layer: 46.99,21.96 46.99,18.4 46.86,18.28 41.4,18.28 41.28,18.4 41.28,21.32 41.91,21.96
12V+ on Top Layer: 46.99,13.07 46.99,9.51 46.86,9.39 41.4,9.39 41.28,9.51 41.28,12.43 41.91,13.07
12V+ on Top Layer: 46.99,48.25 46.99,44.69 46.86,44.56 41.4,44.56 41.28,44.69 41.28,47.61 41.91,48.25
12V+ on Top Layer: 47.12,30.72 47.12,27.17 46.99,27.04 41.53,27.04 41.4,27.17 41.4,30.09 42.04,30.72
12V+ on Top Layer: 42.9,13.07 46.99,13.07 46.99,9.39 42.9,9.39
12V+ on Top Layer: 47.07,57.01 47.07,53.45 46.95,53.33 41.48,53.33 41.36,53.45 41.36,56.38 41.99,57.01
12V+ on Top Layer: 46.99,39.61 46.99,36.06 46.86,35.93 41.4,35.93 41.28,36.06 41.28,38.98 41.91,39.61
12V+ on Bottom Layer: 41.19,21.95 46.94,21.95 46.94,18.28 41.19,18.28
12V+ on Bottom Layer: 36.83,57 43.05,57 43.05,5.07 36.83,5.07
12V+ on Bottom Layer: 41.19,13.06 46.94,13.06 46.94,9.39 41.19,9.39
12V+ on Bottom Layer: 41.28,39.35 47.02,39.35 47.02,35.68 41.28,35.68
12V+ on Bottom Layer: 43.05,1.64 36.82,1.64 36.82,5.64 38.35,7.17 38.35,7.23 43.08,7.23 43.08,1.66
12V+ on Bottom Layer: 41.28,57.01 47.02,57.01 47.02,53.33 41.28,53.33
12V+ on Bottom Layer: 41.19,48.24 46.94,48.24 46.94,44.57 41.19,44.57
12V+ on Bottom Layer: 41.32,30.72 47.07,30.72 47.07,27.04 41.32,27.04
12V- on Top Layer: 28.07,26.4 34.81,26.4 34.81,22.09 31.37,22.09 31.37,24.37 30.73,25.01 28.07,25.01
12V- on Top Layer: 28.07,35.29 34.81,35.29 34.81,30.98 31.37,30.98 31.37,33.26 30.73,33.9 28.07,33.9
12V- on Top Layer: 28.07,52.95 34.81,52.95 34.81,48.63 31.37,48.63 31.37,50.91 30.73,51.55 28.07,51.55
12V- on Top Layer: 28.19,17.89 34.94,17.89 34.94,13.58 31.5,13.58 31.5,15.86 30.86,16.5 28.19,16.5
12V- on Top Layer: 28.07,43.8 34.81,43.8 34.81,39.74 31.37,39.74 31.37,41.77 30.73,42.41 28.07,42.41
12V- on Top Layer: 31.62,1.54 36.35,1.51 36.35,5.25 34.5,7.1 31.24,7.1 31.24,1.54
12V- on Top Layer: 28.07,61.46 34.81,61.46 34.81,57.14 31.37,57.14 31.37,59.42 30.73,60.06 28.07,60.06
12V- on Bottom Layer: 30.12,1.77 36.35,1.77 36.35,5.76 34.81,7.29 34.81,7.48 29.71,7.48 29.71,2.17
12V- on Bottom Layer: 29.59,61.46 34.8,61.46 34.8,1.51 29.59,1.51
GND on Bottom Layer: 33.52,86.12 37.1,86.12 37.1,83.98 33.52,83.98
EN_OUT on Bottom Layer: 32.06,70.8 32.02,70.94 31.95,71.07 31.84,71.18 31.71,71.25 31.57,71.29 31.42,71.29 31.28,71.25 31.15,71.18 31.05,71.07 30.97,70.94 30.93,70.8 30.93,70.65 30.97,70.51 31.05,70.38 31.15,70.28 31.28,70.2 31.42,70.16 31.57,70.16 31.71,70.2 31.84,70.28 31.95,70.38 32.02,70.51 32.06,70.65
L1-OUT- on Top Layer: 35.22,61.46 47.08,61.46 47.08,57.32 41.75,57.32 40.04,55.61 35.22,55.61
L1-OUT- on Bottom Layer: 46.99,61.31 43.37,61.31 43.37,57.52 46.99,57.52 46.99,61.31
L2-OUT- on Top Layer: 35.22,52.82 47.08,52.82 47.08,48.56 47.03,48.5 41.57,48.5 40.04,46.98 35.22,46.98
L2-OUT- on Bottom Layer: 47.03,52.8 43.42,52.8 43.42,48.76 47.03,48.76
L3-OUT- on Top Layer: 35.22,44.06 47.08,44.06 47.08,39.79 47.03,39.74 41.57,39.74 40.04,38.21 35.22,38.21
L3-OUT- on Bottom Layer: 47.04,43.91 43.5,43.91 43.5,39.87 47.04,39.87
L4-OUT- on Top Layer: 35.22,35.29 47.08,35.29 47.08,31.03 47.03,30.98 41.57,30.98 40.04,29.45 35.22,29.45
L4-OUT- on Bottom Layer: 47.16,35.14 43.55,35.14 43.55,31.1 47.16,31.1
L5-OUT- on Top Layer: 35.22,26.53 47.08,26.53 47.08,22.27 41.62,22.27 40.04,20.69 35.22,20.69
L5-OUT- on Bottom Layer: 46.91,26.38 43.55,26.38 43.55,22.47 46.91,22.47
L6-OUT- on Top Layer: 35.22,17.64 47.08,17.64 47.08,13.38 47.03,13.32 41.57,13.32 40.04,11.8 35.22,11.8
L6-OUT- on Bottom Layer: 47.03,17.49 43.42,17.49 43.42,13.58 47.03,13.58

Small or netless copper shapes (teardrops, artwork), in the pictures only: 350 on Top Layer, 146 on Bottom Layer

## Text on the board
Bottom Silkscreen Layer: 5V | 3V3 | GND | EN触点
Top Silkscreen Layer: 12V控制信号 | GND EN 1   2  3   4  5  6 | 低        高 | EN | 高        低 | 5-12V | 输入 | 输出 | +  - | +    - | +       - | +        - | 6 | 1 | 2 | 3 | 4 | 5 | + -
